# EAGLE design matrix_main_board (EAGLE 6.6.0)
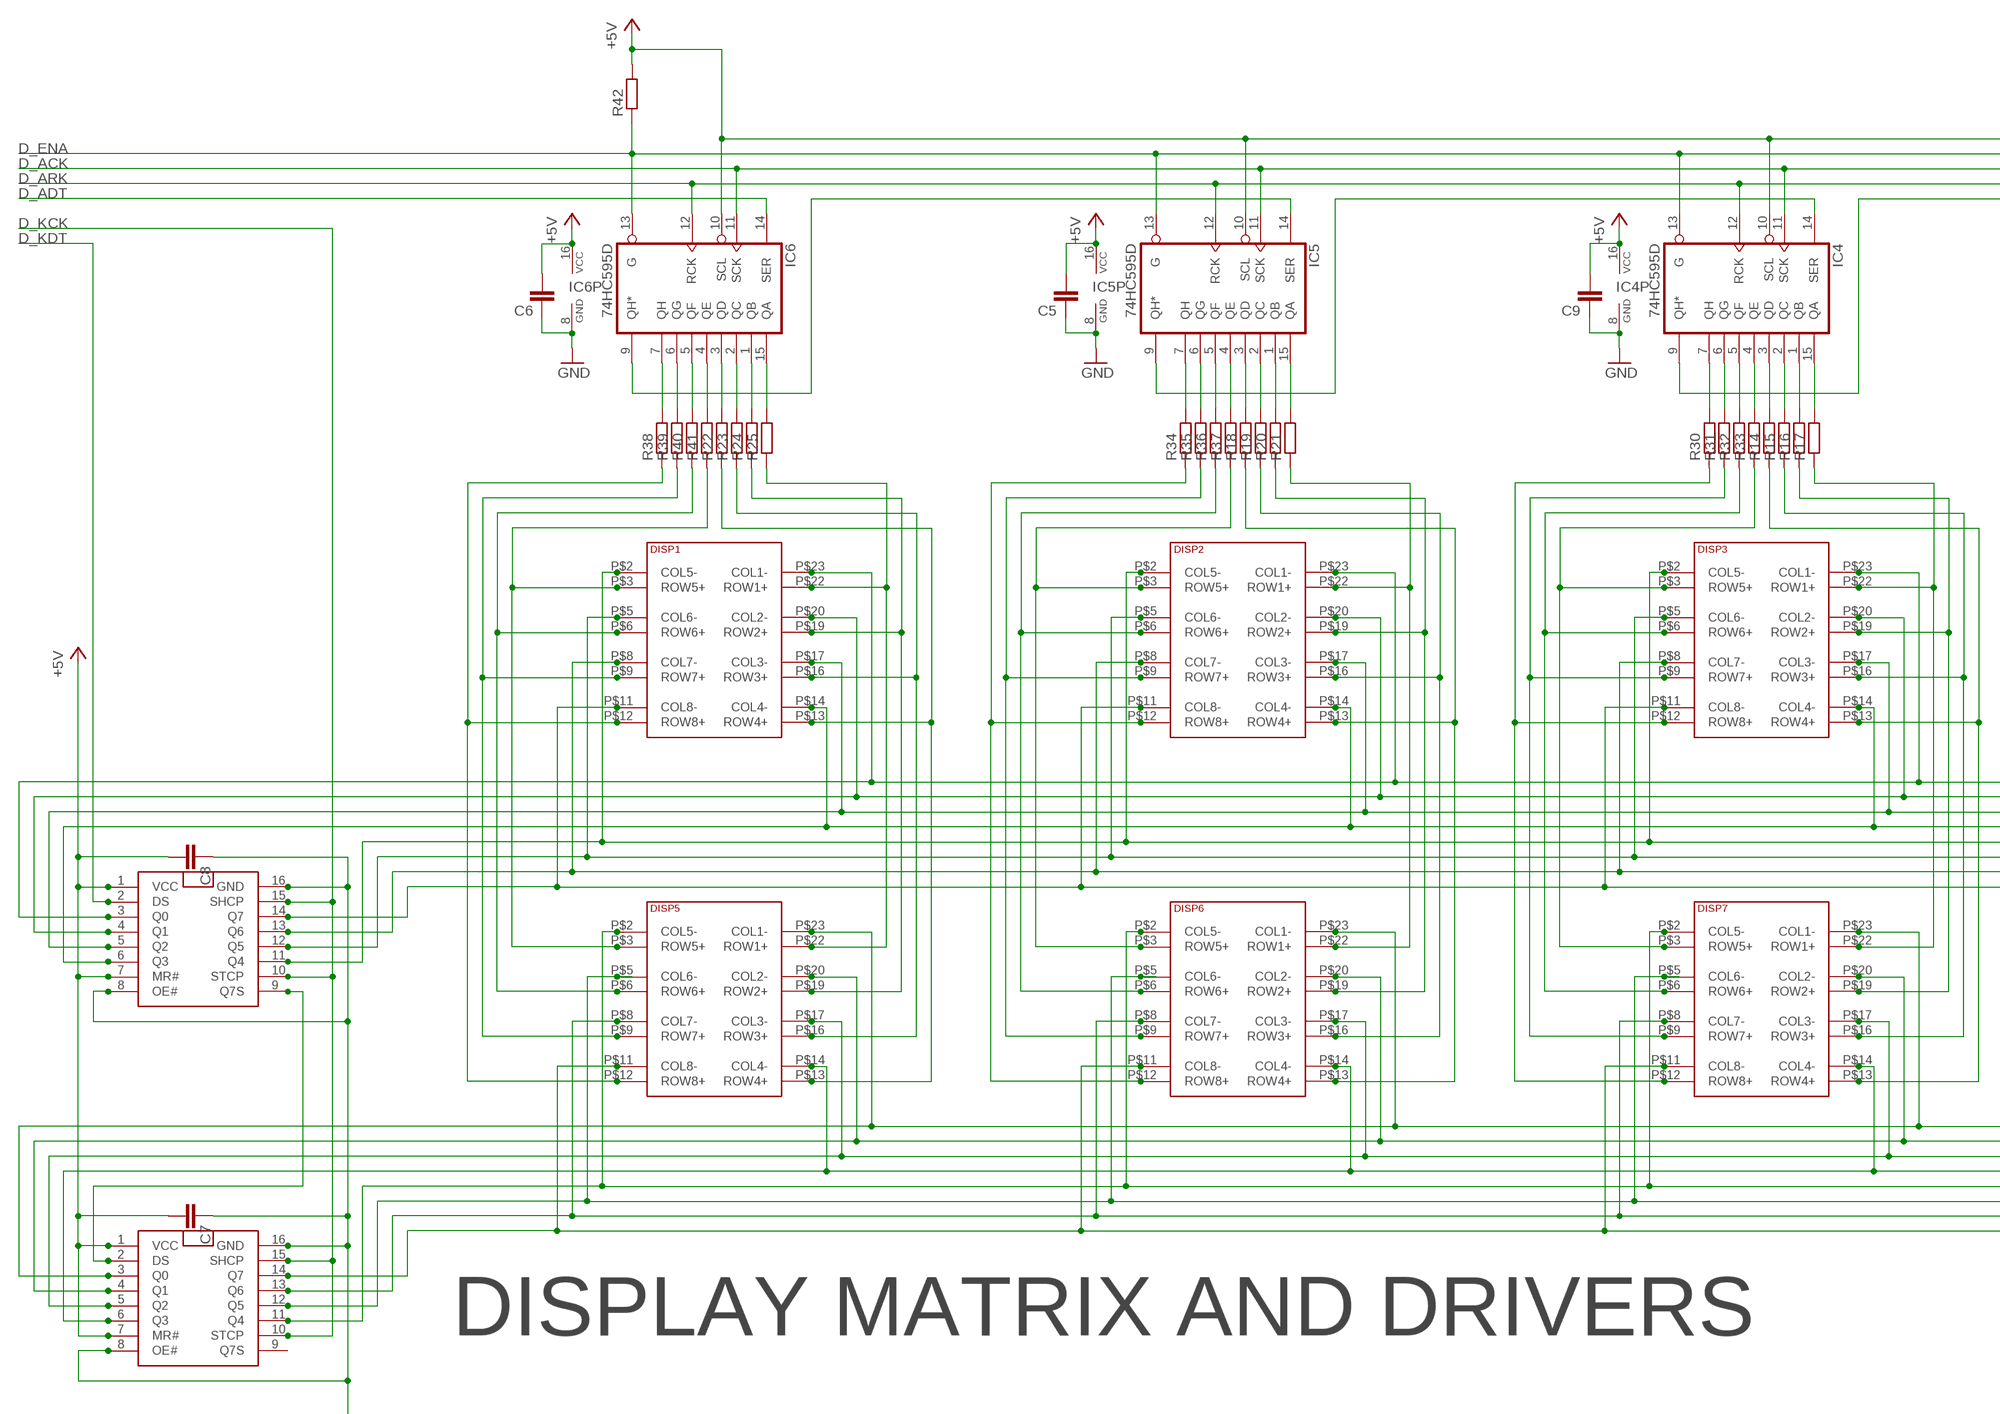
[diagram p0: schematic, sheet 1, part 1 of 3]
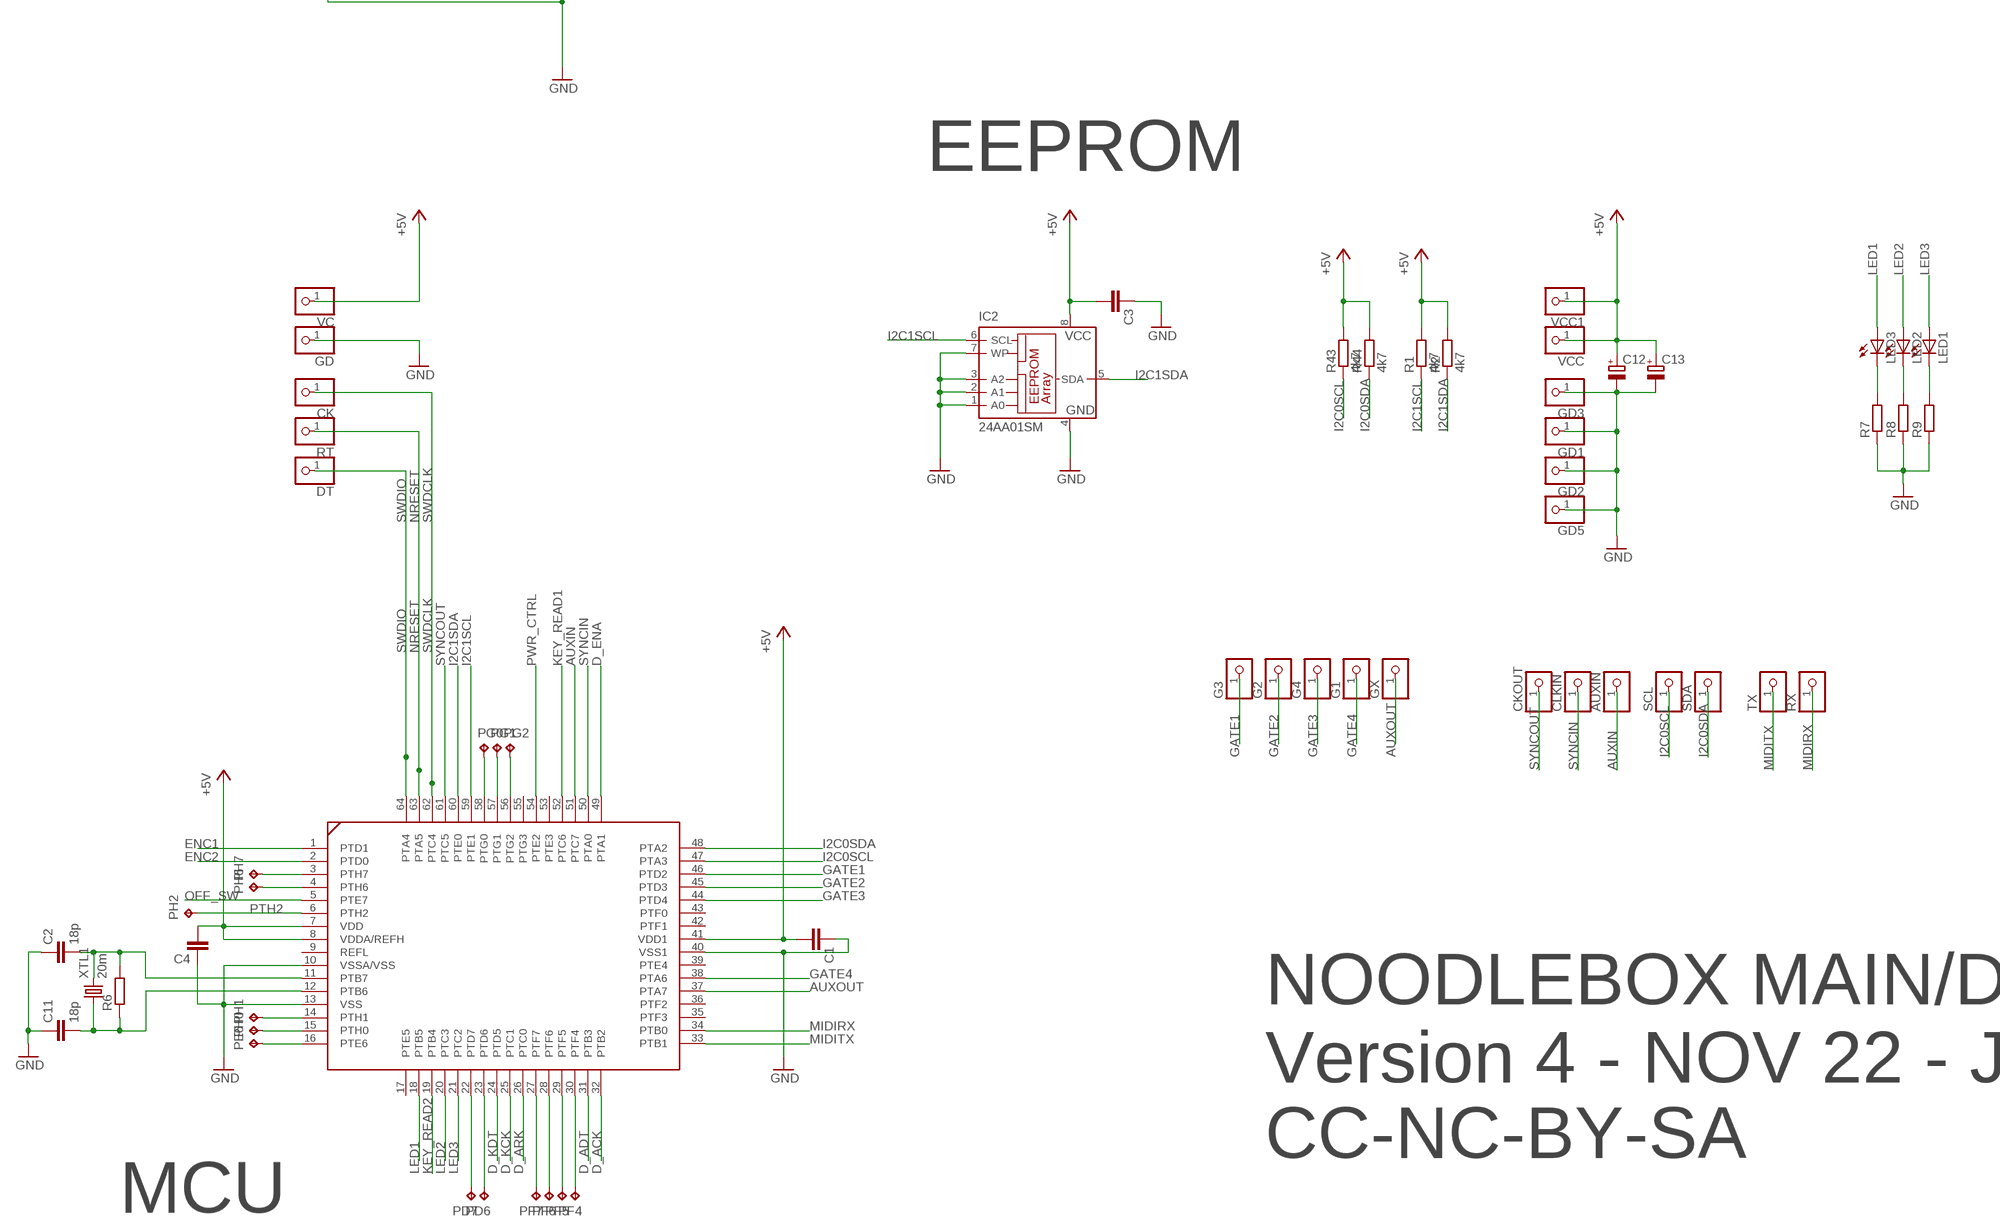
[diagram p1: schematic, sheet 1, part 2 of 3]
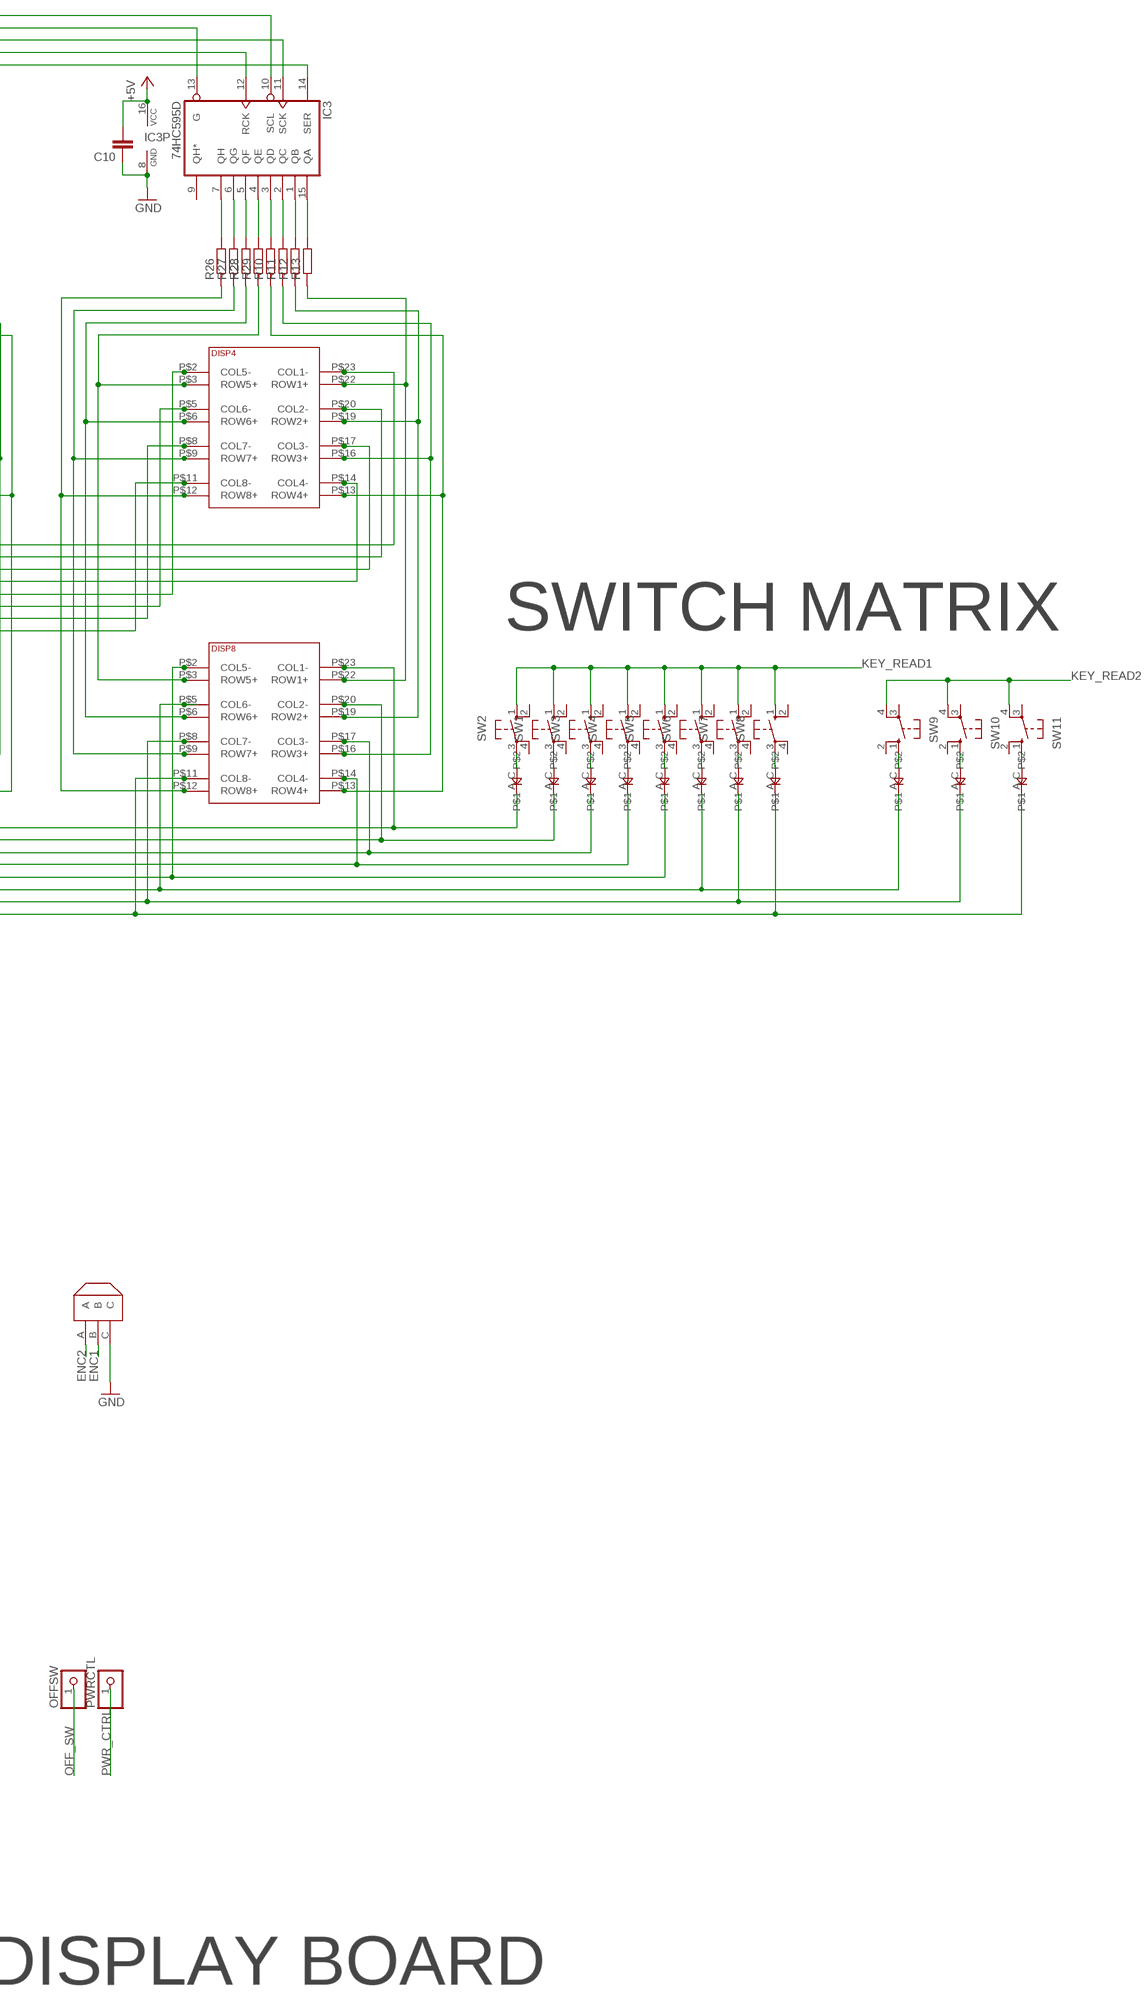
[diagram p2: schematic, sheet 1, part 3 of 3]

## Parts
AUXIN  PINHD-1X1  [1X01]
C1  C-EUC0805  [C0805]
C2  18p  C-EUC0805  [C0805]
C3  C-EUC0805  [C0805]
C4  C-EUC0805  [C0805]
C5  C-EUC0805  [C0805]
C6  C-EUC0805  [C0805]
C7  C-EUC0805  [C0805]
C8  C-EUC0805  [C0805]
C9  C-EUC0805  [C0805]
C10  C-EUC0805  [C0805]
C11  18p  C-EUC0805  [C0805]
C12  CPOL-EUE2.5-7  [E2,5-7]
C13  CPOL-EUE2.5-7  [E2,5-7]
CK  PINHD-1X1  [1X01]
CKOUT  PINHD-1X1  [1X01]
CLKIN  PINHD-1X1  [1X01]
D1  0805DIODE  [0805DIODE]
D2  0805DIODE  [0805DIODE]
D3  0805DIODE  [0805DIODE]
D4  0805DIODE  [0805DIODE]
D5  0805DIODE  [0805DIODE]
D6  0805DIODE  [0805DIODE]
D7  0805DIODE  [0805DIODE]
D8  0805DIODE  [0805DIODE]
D9  0805DIODE  [0805DIODE]
D10  0805DIODE  [0805DIODE]
D11  0805DIODE  [0805DIODE]
DISP1  1388BBMATRIX24PIN  [1388_24PIN]
DISP2  1388BBMATRIX24PIN  [1388_24PIN]
DISP3  1388BBMATRIX24PIN  [1388_24PIN]
DISP4  1388BBMATRIX24PIN  [1388_24PIN]
DISP5  1388BBMATRIX24PIN  [1388_24PIN]
DISP6  1388BBMATRIX24PIN  [1388_24PIN]
DISP7  1388BBMATRIX24PIN  [1388_24PIN]
DISP8  1388BBMATRIX24PIN  [1388_24PIN]
DT  PINHD-1X1  [1X01]
ENC1  ENCODER  [ENCODER]
G1  PINHD-1X1  [1X01]
G2  PINHD-1X1  [1X01]
G3  PINHD-1X1  [1X01]
G4  PINHD-1X1  [1X01]
GD  PINHD-1X1  [1X01]
GD1  PINHD-1X1  [1X01]
GD2  PINHD-1X1  [1X01]
GD3  PINHD-1X1  [1X01]
GD5  PINHD-1X1  [1X01]
GX  PINHD-1X1  [1X01]
IC1  MKE02_64PINQFP64  [QFP64_SOT393]
IC2  24AA01SM  [SO-08M]
IC3  74HC595D  [SO16]
IC4  74HC595D  [SO16]
IC5  74HC595D  [SO16]
IC6  74HC595D  [SO16]
IC7  NPIC6C596  [SO16]
IC8  NPIC6C596  [SO16]
LED1  LED3MM  [LED3MM]
LED2  LED3MM  [LED3MM]
LED3  LED3MM  [LED3MM]
OFFSW  PINHD-1X1  [1X01]
PD6  TPTP17R  [TP17R]
PD7  TPTP17R  [TP17R]
PE6  TPTP17R  [TP17R]
PF4  TPTP17R  [TP17R]
PF5  TPTP17R  [TP17R]
PF6  TPTP17R  [TP17R]
PF7  TPTP17R  [TP17R]
PG0  TPTP17R  [TP17R]
PG1  TPTP17R  [TP17R]
PG2  TPTP17R  [TP17R]
PH0  TPTP17R  [TP17R]
PH1  TPTP17R  [TP17R]
PH2  TPTP17R  [TP17R]
PH6  TPTP17R  [TP17R]
PH7  TPTP17R  [TP17R]
PWRCTL  PINHD-1X1  [1X01]
R1  4k7  R-EU_R0805  [R0805]
R2  4k7  R-EU_R0805  [R0805]
R6  R-EU_R0805  [R0805]
R7  R-EU_R0805  [R0805]
R8  R-EU_R0805  [R0805]
R9  R-EU_R0805  [R0805]
R10  R-EU_R0805  [R0805]
R11  R-EU_R0805  [R0805]
R12  R-EU_R0805  [R0805]
R13  R-EU_R0805  [R0805]
R14  R-EU_R0805  [R0805]
R15  R-EU_R0805  [R0805]
R16  R-EU_R0805  [R0805]
R17  R-EU_R0805  [R0805]
R18  R-EU_R0805  [R0805]
R19  R-EU_R0805  [R0805]
R20  R-EU_R0805  [R0805]
R21  R-EU_R0805  [R0805]
R22  R-EU_R0805  [R0805]
R23  R-EU_R0805  [R0805]
R24  R-EU_R0805  [R0805]
R25  R-EU_R0805  [R0805]
R26  R-EU_R0805  [R0805]
R27  R-EU_R0805  [R0805]
R28  R-EU_R0805  [R0805]
R29  R-EU_R0805  [R0805]
R30  R-EU_R0805  [R0805]
R31  R-EU_R0805  [R0805]
R32  R-EU_R0805  [R0805]
R33  R-EU_R0805  [R0805]
R34  R-EU_R0805  [R0805]
R35  R-EU_R0805  [R0805]
R36  R-EU_R0805  [R0805]
R37  R-EU_R0805  [R0805]
R38  R-EU_R0805  [R0805]
R39  R-EU_R0805  [R0805]
R40  R-EU_R0805  [R0805]
R41  R-EU_R0805  [R0805]
R42  R-EU_R0805  [R0805]
R43  4k7  R-EU_R0805  [R0805]
R44  4k7  R-EU_R0805  [R0805]
RT  PINHD-1X1  [1X01]
RX  PINHD-1X1  [1X01]
SCL  PINHD-1X1  [1X01]
SDA  PINHD-1X1  [1X01]
SW1  40-XX  [B3F-40XX]
SW2  40-XX  [B3F-40XX]
SW3  40-XX  [B3F-40XX]
SW4  40-XX  [B3F-40XX]
SW5  40-XX  [B3F-40XX]
SW6  40-XX  [B3F-40XX]
SW7  40-XX  [B3F-40XX]
SW8  40-XX  [B3F-40XX]
SW9  10-XX  [B3F-10XX]
SW10  10-XX  [B3F-10XX]
SW11  10-XX  [B3F-10XX]
TX  PINHD-1X1  [1X01]
VC  PINHD-1X1  [1X01]
VCC  PINHD-1X1  [1X01]
VCC1  PINHD-1X1  [1X01]
XTL1  20m  CRYSTALHC49S  [HC49/S]

## Nets
+5V: C1.2 C3.2 C4.2 C5.2 C6.2 C7.2 C8.2 C9.2 C10.2 C12.+ C13.+ IC1.7(VDD) IC1.8(VDDA/REFH) IC1.41(VDD1) IC2.8(VCC) IC3.10(SCL) IC3.16(VCC) IC4.10(SCL) IC4.16(VCC) IC5.10(SCL) IC5.16(VCC) IC6.10(SCL) IC6.16(VCC) IC7.1(VCC) IC7.7(MR#) IC8.1(VCC) IC8.7(MR#) R1.2 R2.2 R42.2 R43.2 R44.2 VC.1 VCC1.1 VCC.1
A0: DISP1.P$22(ROW1+) DISP5.P$22(ROW1+) R25.1
A1: DISP1.P$19(ROW2+) DISP5.P$19(ROW2+) R24.1
A2: DISP1.P$16(ROW3+) DISP5.P$16(ROW3+) R23.1
A3: DISP1.P$13(ROW4+) DISP5.P$13(ROW4+) R22.1
A4: DISP1.P$3(ROW5+) DISP5.P$3(ROW5+) R41.1
A5: DISP1.P$6(ROW6+) DISP5.P$6(ROW6+) R40.1
A6: DISP1.P$9(ROW7+) DISP5.P$9(ROW7+) R39.1
A7: DISP1.P$12(ROW8+) DISP5.P$12(ROW8+) R38.1
A8: DISP2.P$22(ROW1+) DISP6.P$22(ROW1+) R21.1
A9: DISP2.P$19(ROW2+) DISP6.P$19(ROW2+) R20.1
A10: DISP2.P$16(ROW3+) DISP6.P$16(ROW3+) R19.1
A11: DISP2.P$13(ROW4+) DISP6.P$13(ROW4+) R18.1
A12: DISP2.P$3(ROW5+) DISP6.P$3(ROW5+) R37.1
A13: DISP2.P$6(ROW6+) DISP6.P$6(ROW6+) R36.1
A14: DISP2.P$9(ROW7+) DISP6.P$9(ROW7+) R35.1
A15: DISP2.P$12(ROW8+) DISP6.P$12(ROW8+) R34.1
A16: DISP3.P$22(ROW1+) DISP7.P$22(ROW1+) R17.1
A17: DISP3.P$19(ROW2+) DISP7.P$19(ROW2+) R16.1
A18: DISP3.P$16(ROW3+) DISP7.P$16(ROW3+) R15.1
A19: DISP3.P$13(ROW4+) DISP7.P$13(ROW4+) R14.1
A20: DISP3.P$3(ROW5+) DISP7.P$3(ROW5+) R33.1
A21: DISP3.P$6(ROW6+) DISP7.P$6(ROW6+) R32.1
A22: DISP3.P$9(ROW7+) DISP7.P$9(ROW7+) R31.1
A23: DISP3.P$12(ROW8+) DISP7.P$12(ROW8+) R30.1
A24: DISP4.P$22(ROW1+) DISP8.P$22(ROW1+) R13.1
A25: DISP4.P$19(ROW2+) DISP8.P$19(ROW2+) R12.1
A26: DISP4.P$16(ROW3+) DISP8.P$16(ROW3+) R11.1
A27: DISP4.P$13(ROW4+) DISP8.P$13(ROW4+) R10.1
A28: DISP4.P$3(ROW5+) DISP8.P$3(ROW5+) R29.1
A29: DISP4.P$6(ROW6+) DISP8.P$6(ROW6+) R28.1
A30: DISP4.P$9(ROW7+) DISP8.P$9(ROW7+) R27.1
A31: DISP4.P$12(ROW8+) DISP8.P$12(ROW8+) R26.1
AUXIN: AUXIN.1 IC1.51(PTC7)
AUXOUT: GX.1 IC1.37(PTA7)
D_ACK: IC1.32(PTB2) IC3.11(SCK) IC4.11(SCK) IC5.11(SCK) IC6.11(SCK)
D_ADT: IC1.31(PTB3) IC6.14(SER)
D_ARK: IC1.26(PTC0) IC3.12(RCK) IC4.12(RCK) IC5.12(RCK) IC6.12(RCK)
D_ENA: IC1.49(PTA1) IC3.13(G) IC4.13(G) IC5.13(G) IC6.13(G) R42.1
D_KCK: IC1.25(PTC1) IC7.10(STCP) IC7.15(SHCP) IC8.10(STCP) IC8.15(SHCP)
D_KDT: IC1.24(PTD5) IC8.2(DS)
ENC1: ENC1.B IC1.1(PTD1)
ENC2: ENC1.A IC1.2(PTD0)
GATE1: G3.1 IC1.46(PTD2)
GATE2: G2.1 IC1.45(PTD3)
GATE3: G4.1 IC1.44(PTD4)
GATE4: G1.1 IC1.38(PTA6)
GND: C1.1 C2.1 C3.1 C4.1 C5.1 C6.1 C7.1 C8.1 C9.1 C10.1 C11.1 C12.- C13.- ENC1.C GD1.1 GD2.1 GD3.1 GD5.1 GD.1 IC1.10(VSSA/VSS) IC1.13(VSS) IC1.40(VSS1) IC2.1(A0) IC2.2(A1) IC2.3(A2) IC2.4(GND) IC2.7(WP) IC3.8(GND) IC4.8(GND) IC5.8(GND) IC6.8(GND) IC7.8(OE#) IC7.16(GND) IC8.8(OE#) IC8.16(GND) R7.1 R8.1 R9.1
I2C0SCL: IC1.47(PTA3) R43.1 SCL.1
I2C0SDA: IC1.48(PTA2) R44.1 SDA.1
I2C1SCL: IC1.59(PTE1) IC2.6(SCL) R1.1
I2C1SDA: IC1.60(PTE0) IC2.5(SDA) R2.1
K0: DISP1.P$23(COL1-) DISP2.P$23(COL1-) DISP3.P$23(COL1-) DISP4.P$23(COL1-) IC8.3(Q0)
K1: DISP1.P$20(COL2-) DISP2.P$20(COL2-) DISP3.P$20(COL2-) DISP4.P$20(COL2-) IC8.4(Q1)
K2: DISP1.P$17(COL3-) DISP2.P$17(COL3-) DISP3.P$17(COL3-) DISP4.P$17(COL3-) IC8.5(Q2)
K3: DISP1.P$14(COL4-) DISP2.P$14(COL4-) DISP3.P$14(COL4-) DISP4.P$14(COL4-) IC8.6(Q3)
K4: DISP1.P$2(COL5-) DISP2.P$2(COL5-) DISP3.P$2(COL5-) DISP4.P$2(COL5-) IC8.11(Q4)
K5: DISP1.P$5(COL6-) DISP2.P$5(COL6-) DISP3.P$5(COL6-) DISP4.P$5(COL6-) IC8.12(Q5)
K6: DISP1.P$8(COL7-) DISP2.P$8(COL7-) DISP3.P$8(COL7-) DISP4.P$8(COL7-) IC8.13(Q6)
K7: DISP1.P$11(COL8-) DISP2.P$11(COL8-) DISP3.P$11(COL8-) DISP4.P$11(COL8-) IC8.14(Q7)
K8: D7.A DISP5.P$23(COL1-) DISP6.P$23(COL1-) DISP7.P$23(COL1-) DISP8.P$23(COL1-) IC7.3(Q0)
K9: D8.A DISP5.P$20(COL2-) DISP6.P$20(COL2-) DISP7.P$20(COL2-) DISP8.P$20(COL2-) IC7.4(Q1)
K10: D6.A DISP5.P$17(COL3-) DISP6.P$17(COL3-) DISP7.P$17(COL3-) DISP8.P$17(COL3-) IC7.5(Q2)
K11: D5.A DISP5.P$14(COL4-) DISP6.P$14(COL4-) DISP7.P$14(COL4-) DISP8.P$14(COL4-) IC7.6(Q3)
K12: D4.A DISP5.P$2(COL5-) DISP6.P$2(COL5-) DISP7.P$2(COL5-) DISP8.P$2(COL5-) IC7.11(Q4)
K13: D3.A D11.A DISP5.P$5(COL6-) DISP6.P$5(COL6-) DISP7.P$5(COL6-) DISP8.P$5(COL6-) IC7.12(Q5)
K14: D2.A D10.A DISP5.P$8(COL7-) DISP6.P$8(COL7-) DISP7.P$8(COL7-) DISP8.P$8(COL7-) IC7.13(Q6)
K15: D1.A D9.A DISP5.P$11(COL8-) DISP6.P$11(COL8-) DISP7.P$11(COL8-) DISP8.P$11(COL8-) IC7.14(Q7)
KEY_READ1: IC1.52(PTC6) SW1.1(S) SW2.1(S) SW3.1(S) SW4.1(S) SW5.1(S) SW6.1(S) SW7.1(S) SW8.1(S)
KEY_READ2: IC1.19(PTB4) SW9.4(P1) SW10.4(P1) SW11.4(P1)
LED1: IC1.18(PTB5) LED3.A
LED2: IC1.20(PTC3) LED2.A
LED3: IC1.21(PTC2) LED1.A
MIDIRX: IC1.34(PTB0) RX.1
MIDITX: IC1.33(PTB1) TX.1
N$1: D10.C SW10.1(S)
N$2: LED3.K(C) R7.2
N$3: LED2.K(C) R8.2
N$4: C2.2 IC1.11(PTB7) R6.2 XTL1.2
N$5: C11.2 IC1.12(PTB6) R6.1 XTL1.1
N$6: LED1.K(C) R9.2
N$7: D9.C SW11.1(S)
N$8: D11.C SW9.1(S)
N$9: D7.C SW2.3(P)
N$10: IC1.22(PTD7) PD7.TP
N$11: D8.C SW1.3(P)
N$12: IC1.23(PTD6) PD6.TP
N$13: D6.C SW3.3(P)
N$14: D5.C SW4.3(P)
N$15: IC1.27(PTF7) PF7.TP
N$16: D4.C SW5.3(P)
N$17: IC6.15(QA) R25.2
N$18: IC6.1(QB) R24.2
N$19: IC6.2(QC) R23.2
N$20: IC6.3(QD) R22.2
N$21: IC6.4(QE) R41.2
N$22: IC6.5(QF) R40.2
N$23: IC6.6(QG) R39.2
N$24: IC6.7(QH) R38.2
N$25: IC1.28(PTF6) PF6.TP
N$26: IC1.29(PTF5) PF5.TP
N$27: IC1.30(PTF4) PF4.TP
N$30: IC5.14(SER) IC6.9(QH*)
N$31: IC4.14(SER) IC5.9(QH*)
N$32: IC3.14(SER) IC4.9(QH*)
N$36: IC1.14(PTH1) PH1.TP
N$37: IC1.15(PTH0) PH0.TP
N$38: IC1.16(PTE6) PE6.TP
N$41: IC1.4(PTH6) PH6.TP
N$43: IC1.57(PTG1) PG1.TP
N$49: IC5.15(QA) R21.2
N$50: IC5.1(QB) R20.2
N$51: IC5.2(QC) R19.2
N$52: IC5.3(QD) R18.2
N$53: IC5.4(QE) R37.2
N$54: IC5.5(QF) R36.2
N$55: IC5.6(QG) R35.2
N$56: IC5.7(QH) R34.2
N$60: D3.C SW6.3(P)
N$61: D2.C SW7.3(P)
N$62: D1.C SW8.3(P)
N$81: IC4.15(QA) R17.2
N$82: IC4.1(QB) R16.2
N$83: IC4.2(QC) R15.2
N$84: IC4.3(QD) R14.2
N$85: IC4.4(QE) R33.2
N$86: IC4.5(QF) R32.2
N$87: IC4.6(QG) R31.2
N$88: IC4.7(QH) R30.2
N$113: IC3.15(QA) R13.2
N$114: IC3.1(QB) R12.2
N$115: IC3.2(QC) R11.2
N$116: IC3.3(QD) R10.2
N$117: IC3.4(QE) R29.2
N$118: IC3.5(QF) R28.2
N$119: IC3.6(QG) R27.2
N$120: IC3.7(QH) R26.2
N$122: IC7.2(DS) IC8.9(Q7S)
NRESET: IC1.63(PTA5) RT.1
OFF_SW: IC1.5(PTE7) OFFSW.1
PG0: IC1.58(PTG0) PG0.TP
PTG2: IC1.56(PTG2) PG2.TP
PTH2: IC1.6(PTH2) PH2.TP
PTH7: IC1.3(PTH7) PH7.TP
PWR_CTRL: IC1.54(PTE2) PWRCTL.1
SWDCLK: CK.1 IC1.62(PTC4)
SWDIO: DT.1 IC1.64(PTA4)
SYNCIN: CLKIN.1 IC1.50(PTA0)
SYNCOUT: CKOUT.1 IC1.61(PTC5)
Unconnected: IC1.9(REFL) IC1.17(PTE5) IC1.35(PTF3) IC1.36(PTF2) IC1.39(PTE4) IC1.42(PTF1) IC1.43(PTF0) IC1.53(PTE3) IC1.55(PTG3) IC3.9(QH*) IC7.9(Q7S) SW1.2(S1) SW1.4(P1) SW2.2(S1) SW2.4(P1) SW3.2(S1) SW3.4(P1) SW4.2(S1) SW4.4(P1) SW5.2(S1) SW5.4(P1) SW6.2(S1) SW6.4(P1) SW7.2(S1) SW7.4(P1) SW8.2(S1) SW8.4(P1) SW9.2(S1) SW9.3(P) SW10.2(S1) SW10.3(P) SW11.2(S1) SW11.3(P)

## Notes on the sheet
- SWITCH MATRIX
- DISPLAY MATRIX AND DRIVERS
- EEPROM
- NOODLEBOX MAIN/DISPLAY BOARD
- Version 4 - NOV 22 - J Hotchkiss / Sixty Four Pixels
- CC-NC-BY-SA
- MCU

## Library data of the parts
AUXIN CK CKOUT CLKIN DT G1-G4 GD GD1-GD3 GD5 GX OFFSW PWRCTL RT RX SCL SDA TX VC VCC VCC1 = pinhead:PINHD-1X1: PIN HEADER
C1-C11 = rcl:C-EU: CAPACITOR, European symbol
C12 C13 = rcl:CPOL-EU: POLARIZED CAPACITOR, European symbol
D1-D11 = jasons_stuff:0805DIODE
DISP1-DISP8 = jason_eagle6:1388BBMATRIX
ENC1 = jason_eagle6:ENCODER: "PEC16-4220F-N0024"
IC1 = jason_eagle6:MKE02_64PIN
IC2 = microchip:24*: Serial EEPROM I2C; MF: MICROCHIP; MPN: 24AA01-I/SN; OC_FARNELL: 1331268; OC_NEWARK: 92C6793
IC3-IC6 = 74xx-eu:74*595: 8-bit SHIFT REGISTER, output latch
IC7 IC8 = jasons_stuff:NPIC6C596
LED1-LED3 = led:LED: LED OSRAM: - CHIPLED LG R971, LG N971, LY N971, LG Q971, LY Q971, LO R971, LY R971 LH N974, LH R974 LS Q976, LO Q976, LY Q976 LO Q996 - Hyper CHIPLED LW Q18S LB Q993, LB Q99A, LB R99A - SideLED LS A670, LO A670, LY A670, LG A670, LP A670 LB A673, LV A673, LT A673, LW A673 LH A674 LY A675 LS A676, LA A676, LO A676, LY A676, LW A676 LS A679, LY A679, LG A679 - Hyper Micro SIDELED® LS Y876, LA Y876, LO Y876, LY Y876 LT Y87S - SmartLED LW L88C, LW L88S LB L89C, LB L89S, LG L890 LS L89K, LO L89K, LY L89K LS L896, LA L896, LO L896, LY L896 - TOPLED LS T670, LO T670, LY T670, LG T670, LP T670 LSG T670, LSP T670, LSY T670, LOP T670, LYG T670 LG T671, LOG T671, LSG T671 LB T673, LV T673, LT T673, LW T673 LH T674 LS T676, LA T676, LO T676, LY T676, LB T676, LH T676, LSB T676, LW T676 LB T67C, LV T67C, LT T67C, LS T67K, LO T67K, LY T67K, LW E67C LS E67B, LA E67B, LO E67B, LY E67B, LB E67C, LV E67C, LT E67C LW T67C LS T679, LY T679, LG T679 LS T770, LO T770, LY T770, LG T770, LP T770 LB T773, LV T773, LT T773, LW T773 LH T774 LS E675, LA E675, LY E675, LS T675 LS T776, LA T776, LO T776, LY T776, LB T776 LHGB T686 LT T68C, LB T68C - Hyper Mini TOPLED® LB M676 - Mini TOPLED Santana® LG M470 LS M47K, LO M47K, LY M47K Source: http://www.osram.convergy.de LUXEON: - LUMILED® LXK2-PW12-R00, LXK2-PW12-S00, LXK2-PW14-U00, LXK2-PW14-V00 LXK2-PM12-R00, LXK2-PM12-S00, LXK2-PM14-U00 LXK2-PE12-Q00, LXK2-PE12-R00, LXK2-PE12-S00, LXK2-PE14-T00, LXK2-PE14-U00 LXK2-PB12-K00, LXK2-PB12-L00, LXK2-PB12-M00, LXK2-PB14-N00, LXK2-PB14-P00, LXK2-PB14-Q00 LXK2-PR12-L00, LXK2-PR12-M00, LXK2-PR14-Q00, LXK2-PR14-R00 LXK2-PD12-Q00, LXK2-PD12-R00, LXK2-PD12-S00 LXK2-PH12-R00, LXK2-PH12-S00 LXK2-PL12-P00, LXK2-PL12-Q00, LXK2-PL12-R00 Source: www.luxeon.com KINGBRIGHT: KA-3528ASYC Source: www.kingbright.com
PD6 PD7 PE6 PF4-PF7 PG0 PG1 PG2 PH0 PH1 PH2 PH6 PH7 = testpad:TP: Test pad
R1 R2 R6-R44 = rcl:R-EU_: RESISTOR, European symbol
SW1-SW8 = switch-omron:40-XX: OMRON SWITCH; MF: OMRON COMPONENTS USA; MPN: B3F-4000; OC_FARNELL: 176434; OC_NEWARK: 36K3105
SW9-SW11 = switch-omron:10-XX: OMRON SWITCH; MPN: B3F-1000; OC_FARNELL: 176432; OC_NEWARK: 36M3542
XTL1 = crystal:CRYSTAL: CRYSTAL; OC_FARNELL: 1667008; OC_NEWARK: unknown

## Board
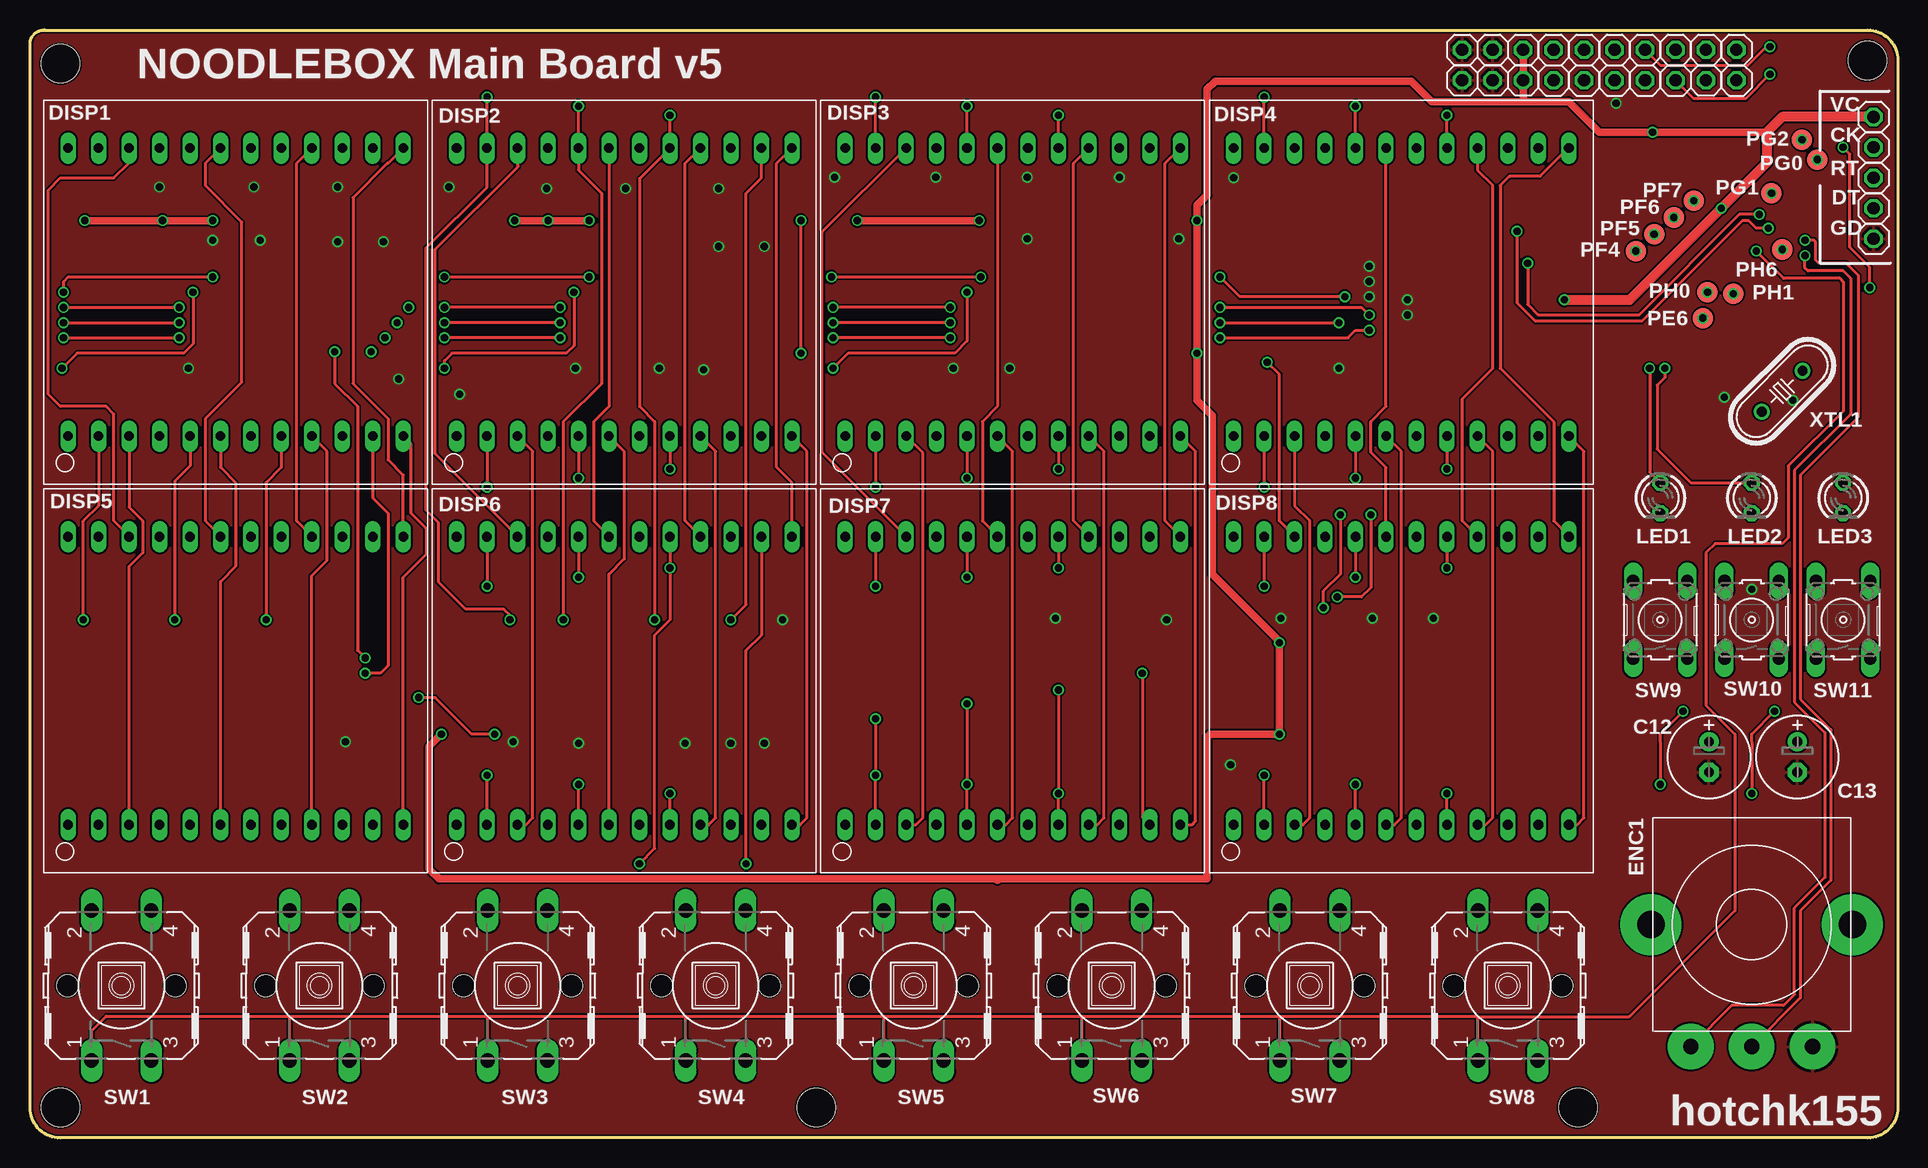
[diagram p3: board, top side]
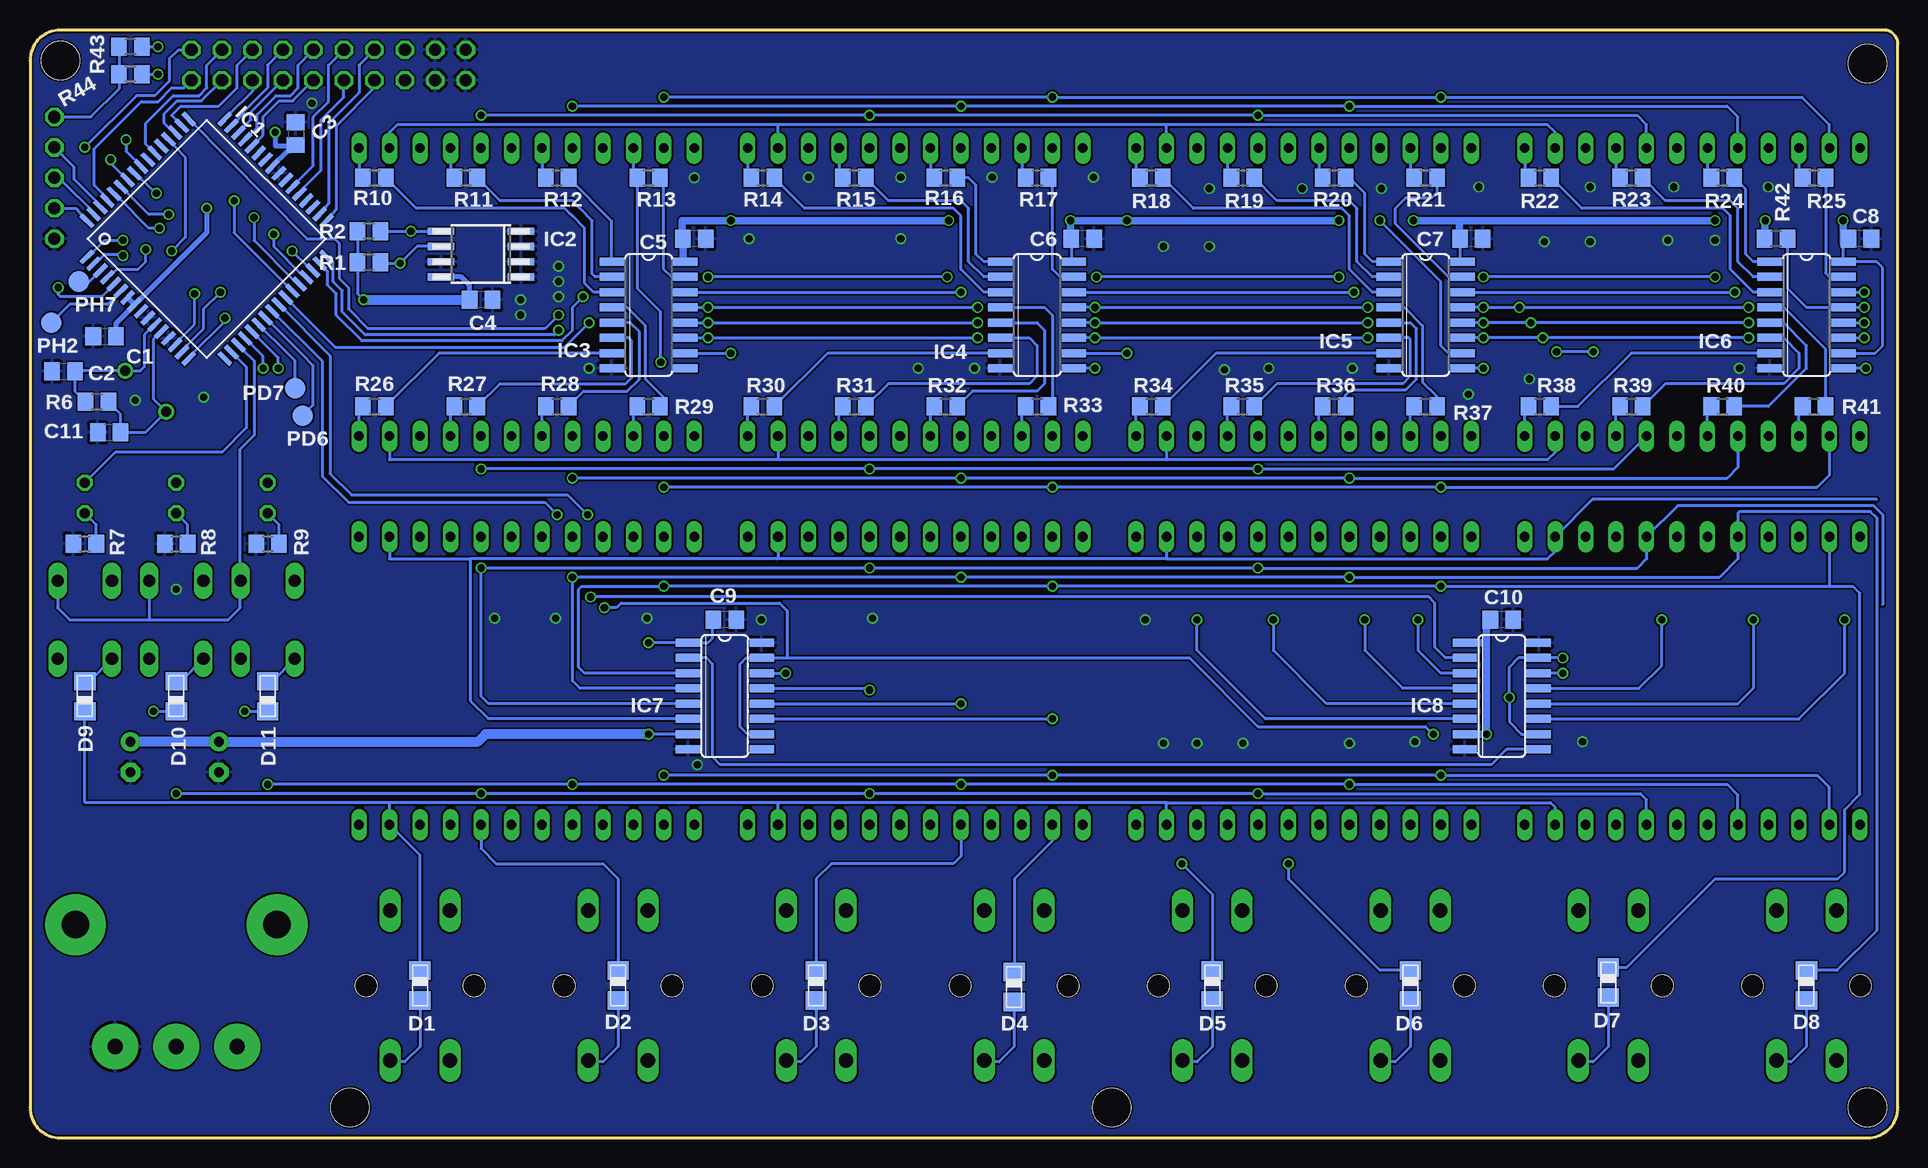
[diagram p4: board, bottom side, seen from below]

Size 155.7 x 92.33 mm. Coordinates in mm from the lower left corner, seen from the top.
Outline: 155.7,2.54 arc-90 153.16,0 2.54,0 arc-90 0,2.54 0,91.19 arc-93 1.27,92.33 153.16,92.33 arc-90 155.7,89.79 155.7,2.54
Copper layers (1*16): Top 0.035mm / dielectric 1.5mm / Bottom 0.035mm
Design rules "hackvana": minimum track width 6mil, minimum drill 0.3mm, track to track 6mil, track to pad 9mil, pad to pad 6mil, via to via 6mil, smd to smd 0mil, copper to edge 6mil, drill to drill 6mil, minimum pad ring 10mil, minimum via ring 6mil, stop-mask expansion 2mil, vias tented up to drill 100mil, thermal gap 10mil
Holes 3.2 mm at 2.54,2.54 2.54,89.53 153.16,89.79 65.53,2.54 129.03,2.54

### Footprints (pad centres in the part's own frame; a part is rotated, then mirrored left to right if it is on the bottom)
1X01 = drill 1.016 octagon: 1 0,0
C0805 = smd 1.3 x 1.5: 1 -0.95,0; 2 0.95,0
E2,5-7 = drill 0.813 pad 1.6: + -1.27,0 | drill 0.813 pad 1.6 octagon: - 1.27,0
0805DIODE = smd 1.524 x 1.778: A -1.262,-0.005; C 1.238,-0.005
1388_24PIN = drill 0.8 long: P$1 -13.97,-12; P$2 -11.43,-12; P$3 -8.89,-12; P$4 -6.35,-12; P$5 -3.81,-12; P$6 -1.27,-12; P$7 1.27,-12; P$8 3.81,-12; P$9 6.35,-12; P$10 8.89,-12; P$11 11.43,-12; P$12 13.97,-12; P$13 13.97,12; P$14 11.43,12; P$15 8.89,12; P$16 6.35,12; P$17 3.81,12; P$18 1.27,12; P$19 -1.27,12; P$20 -3.81,12; P$21 -6.35,12; P$22 -8.89,12; P$23 -11.43,12; P$24 -13.97,12
ENCODER = drill 1.27 pad 3.81: A 5.08,10.16; B 0,10.16; C -5.08,10.16 | drill 2.286 pad 5.08: P$1 8.4,0; P$2 -8.4,0
QFP64_SOT393 = smd 0.4 x 1.4: 1 -6,-8.125; 2 -5.2,-8.125; 3 -4.4,-8.125; 4 -3.6,-8.125; 5 -2.8,-8.125; 6 -2,-8.125; 7 -1.2,-8.125; 8 -0.4,-8.125; 9 0.4,-8.125; 10 1.2,-8.125; 11 2,-8.125; 12 2.8,-8.125; 13 3.6,-8.125; 14 4.4,-8.125; 15 5.2,-8.125; 16 6,-8.125; 33 6,8.125; 34 5.2,8.125; 35 4.4,8.125; 36 3.6,8.125; 37 2.8,8.125; 38 2,8.125; 39 1.2,8.125; 40 0.4,8.125; 41 -0.4,8.125; 42 -1.2,8.125; 43 -2,8.125; 44 -2.8,8.125; 45 -3.6,8.125; 46 -4.4,8.125; 47 -5.2,8.125; 48 -6,8.125 | smd 1.4 x 0.4: 17 8.125,-6; 18 8.125,-5.2; 19 8.125,-4.4; 20 8.125,-3.6; 21 8.125,-2.8; 22 8.125,-2; 23 8.125,-1.2; 24 8.125,-0.4; 25 8.125,0.4; 26 8.125,1.2; 27 8.125,2; 28 8.125,2.8; 29 8.125,3.6; 30 8.125,4.4; 31 8.125,5.2; 32 8.125,6; 49 -8.125,6; 50 -8.125,5.2; 51 -8.125,4.4; 52 -8.125,3.6; 53 -8.125,2.8; 54 -8.125,2; 55 -8.125,1.2; 56 -8.125,0.4; 57 -8.125,-0.4; 58 -8.125,-1.2; 59 -8.125,-2; 60 -8.125,-2.8; 61 -8.125,-3.6; 62 -8.125,-4.4; 63 -8.125,-5.2; 64 -8.125,-6
SO-08M = smd 0.6 x 2.2: 1 -1.905,-3.33; 2 -0.635,-3.33; 3 0.635,-3.33; 4 1.905,-3.33; 5 1.905,3.33; 6 0.635,3.33; 7 -0.635,3.33; 8 -1.905,3.33
SO16 = smd 0.66 x 2.032: 1 -4.445,-3.073; 2 -3.175,-3.073; 3 -1.905,-3.073; 4 -0.635,-3.073; 5 0.635,-3.073; 6 1.905,-3.073; 7 3.175,-3.073; 8 4.445,-3.073; 9 4.445,3.073; 10 3.175,3.073; 11 1.905,3.073; 12 0.635,3.073; 13 -0.635,3.073; 14 -1.905,3.073; 15 -3.175,3.073; 16 -4.445,3.073
LED3MM = drill 0.813 octagon: A -1.27,0; K 1.27,0
TP17R = smd 1.7 x 1.7: TP 0,0
R0805 = smd 1.3 x 1.5: 1 -0.95,0; 2 0.95,0
B3F-40XX = drill 1.194 long: 1 -6.248,2.489; 2 6.248,2.489; 3 -6.248,-2.489; 4 6.248,-2.489 | hole 1.803: 0,-4.496; 0,4.496
B3F-10XX = drill 1.016 long: 1 -3.251,2.261; 2 3.251,2.261; 3 -3.251,-2.261; 4 3.251,-2.261
HC49/S = drill 0.813: 1 -2.413,0; 2 2.413,0

### Placement (x,y rotation side)
AUXIN  139.7,88.14 0 top
C1  149.48,66.8 0 bottom
C2  152.91,63.88 0 bottom
C3  133.54,83.69 270 bottom
C4  118.11,69.85 180 bottom
C5  100.33,74.93 180 bottom
C6  67.95,74.93 180 bottom
C7  35.56,74.93 180 bottom
C8  3.18,74.93 180 bottom
C9  97.79,43.18 180 bottom
C10  33.02,43.18 180 bottom
C11  149.1,58.8 0 bottom
C12  139.95,31.75 270 top
C13  147.32,31.75 270 top
CK  153.67,82.55 0 top
CKOUT  142.24,88.14 90 top
CLKIN  137.16,90.68 90 top
D1  123.19,12.7 270 bottom
D2  106.68,12.7 270 bottom
D3  90.17,12.7 270 bottom
D4  73.66,12.57 270 bottom
D5  57.15,12.7 270 bottom
D6  40.64,12.7 270 bottom
D7  24.13,12.95 270 bottom
D8  7.62,12.7 270 bottom
D9  151.13,36.83 90 bottom
D10  143.51,36.83 90 bottom
D11  135.89,36.83 90 bottom
DISP1  17.14,70.48 0 top
DISP2  49.53,70.48 0 top
DISP3  81.92,70.48 0 top
DISP4  114.3,70.48 0 top
DISP5  17.14,38.1 0 top
DISP6  49.53,38.1 0 top
DISP7  81.92,38.1 0 top
DISP8  114.3,38.1 0 top
DT  153.67,77.47 0 top
ENC1  143.51,17.78 180 top
G1  129.54,90.68 90 top
G2  132.08,90.68 90 top
G3  134.62,88.14 90 top
G4  132.08,88.14 90 top
GD  153.67,74.93 0 top
GD1  121.92,90.68 0 top
GD2  119.38,90.68 0 top
GD3  119.38,88.14 0 top
GD5  121.92,88.14 0 top
GX  129.54,88.14 90 top
IC1  140.97,74.93 315 bottom
IC2  118.11,73.66 90 bottom
IC3  104.14,68.58 270 bottom
IC4  71.76,68.58 270 bottom
IC5  39.37,68.58 270 bottom
IC6  7.62,68.58 270 bottom
IC7  97.79,36.83 270 bottom
IC8  33.02,36.83 270 bottom
LED1  135.89,53.34 270 top
LED2  143.51,53.34 270 top
LED3  151.13,53.34 270 top
OFFSW  142.24,90.68 90 top
PD6  132.97,60.2 0 bottom
PD7  133.6,62.48 0 bottom
PE6  139.45,68.33 0 top
PF4  133.86,73.91 0 top
PF5  135.38,75.31 0 top
PF6  137.03,76.71 0 top
PF7  138.68,78.11 0 top
PG0  148.97,81.53 90 top
PG1  145.16,78.74 90 top
PG2  147.7,83.19 90 top
PH0  139.83,70.48 0 top
PH1  141.99,70.36 0 top
PH2  153.92,67.94 0 bottom
PH6  146.05,74.04 0 top
PH7  151.64,71.37 0 bottom
PWRCTL  139.7,90.68 90 top
R1  127.44,72.96 180 bottom
R2  127.44,75.56 180 bottom
R6  150.11,61.34 180 bottom
R7  151.13,49.53 0 bottom
R8  143.51,49.53 0 bottom
R9  135.89,49.53 0 bottom
R10  127,80.01 0 bottom
R11  119.38,80.01 0 bottom
R12  111.76,80.01 0 bottom
R13  104.14,80.01 0 bottom
R14  94.62,80.01 0 bottom
R15  87,80.01 0 bottom
R16  79.38,80.01 0 bottom
R17  71.76,80.01 0 bottom
R18  62.23,80.01 0 bottom
R19  54.61,80.01 0 bottom
R20  46.99,80.01 0 bottom
R21  39.37,80.01 0 bottom
R22  29.84,80.01 0 bottom
R23  22.23,80.01 0 bottom
R24  14.61,80.01 0 bottom
R25  6.99,80.01 0 bottom
R26  127,60.96 0 bottom
R27  119.38,60.96 0 bottom
R28  111.76,60.96 0 bottom
R29  104.14,60.96 0 bottom
R30  94.62,60.96 0 bottom
R31  87,60.96 0 bottom
R32  79.38,60.96 0 bottom
R33  71.76,60.96 0 bottom
R34  62.23,60.96 0 bottom
R35  54.61,60.96 0 bottom
R36  46.99,60.96 0 bottom
R37  39.37,60.96 0 bottom
R38  29.84,60.96 0 bottom
R39  22.23,60.96 0 bottom
R40  14.61,60.96 0 bottom
R41  6.99,60.96 0 bottom
R42  10.16,74.93 180 bottom
R43  147.32,90.93 180 bottom
R44  147.32,88.65 180 bottom
RT  153.67,80.01 0 top
RX  127,90.68 90 top
SCL  134.62,90.68 90 top
SDA  137.16,88.14 90 top
SW1  7.62,12.7 90 top
SW2  24.13,12.7 90 top
SW3  40.64,12.7 90 top
SW4  57.15,12.7 90 top
SW5  73.66,12.7 90 top
SW6  90.17,12.7 90 top
SW7  106.68,12.7 90 top
SW8  123.19,12.7 90 top
SW9  135.89,43.18 90 top
SW10  143.51,43.18 90 top
SW11  151.13,43.18 90 top
TX  127,88.14 90 top
VC  153.67,85.09 0 top
VCC  124.46,90.68 0 top
VCC1  124.46,88.14 0 top
XTL1  146.05,62.23 45 top

### Tracks (layer width: path | path; a pad name or v marks a point on that pad's centre or on a via)
+5V  (via drill 0.6, 0.6 pad 0.25)
  Top 0.254: v64.26,65.41 v64.26,76.45 | v43.18,76.45 40.89,76.45 40.64,76.2
  Top 0.61: 80.77,21.59 98.11,21.59 98.11,33.4 98.36,33.66 v104.14,33.66 v104.14,41.27 104.14,41.4 98.55,46.99 98.55,60.2 97.28,61.47 v97.28,65.41 v97.28,76.45 97.28,77.72 98.11,78.55 98.11,87.38 98.81,88.08 115.12,88.08 116.84,86.36 124.46,86.36 | 80.77,21.59 34.1,21.59 33.27,22.42 33.27,32.64 v34.29,33.66 | 80.65,21.46 80.77,21.59 | v4.57,76.45 v11.05,76.45 v15.24,76.45 | v40.39,76.45 v43.18,76.45 v46.61,76.45 | v68.96,76.45 v79.12,76.45 | 124.46,86.36 128.27,86.36 130.81,83.82 v135.25,83.82 144.78,83.82 | VCC.1 VCC1.1 124.46,86.36
  Top 0.813: v127.89,69.85 133.35,69.85 v140.97,77.47 144.78,81.28 144.78,83.82 146.05,85.09 VC.1
  Bottom 0.254: C6.2 68.9,73.24 IC4.16 | C7.2 36.51,73.24 IC5.16 | 4.55,74.51 IC6.16 1.78,73.02 1.27,72.52 1.27,66.04 1.9,65.41 IC6.10 | IC7.7 v104.14,33.66 | v104.14,41.27 IC7.1 99.19,41.27 98.81,41.66 98.81,43.11 C9.2 | IC4.10 v64.26,65.41 | C8.2 4.55,74.93 | IC3.10 v97.28,65.41 | IC5.10 37.46,65.41 38.1,66.04 38.1,71.37 v43.18,76.45 | R2.2 R1.2 128.39,70.36 v127.89,69.85 | R43.2 R44.2 148.27,87.44 150.62,85.09 VC.1
  Bottom 0.406: 134.05,82.41 134.26,82.19 IC1.41 | v135.25,83.82 135.25,82.68 133.54,82.68 C3.2 | IC1.8 146.69,69.72 140.97,75.44 v140.97,77.47 | C4.2 119.06,71.05 119.76,71.75 IC2.8 | IC1.8 147,69.41 148.53,67.88 C1.2 | IC1.8 IC1.7
  Bottom 0.61: 4.55,74.51 4.55,74.93 4.55,76.43 v4.57,76.45 | v15.24,76.45 36.7,76.45 | 36.7,76.45 v40.39,76.45 | C7.2 36.58,75 36.58,76.33 36.7,76.45 | v46.61,76.45 v64.26,76.45 v68.96,76.45 68.96,75 C6.2 | v79.12,76.45 v97.28,76.45 101.35,76.45 101.35,75 C5.2 101.28,73.24 IC3.16 | R42.2 11.11,76.39 v11.05,76.45 | IC8.7 v34.29,33.66 34.29,41.27 | 34.29,41.27 34.29,42.86 C10.2 | IC8.1 34.29,41.27 | C3.2 134.05,82.41 134.05,82.36
  Bottom 0.813: v104.14,33.66 117.73,33.66 118.36,33.02 C12.+ C13.+ | v127.89,69.85 C4.2
A0
  Top 0.254: DISP5.P$22 8.26,50.16 6.99,51.43 6.99,60.33 6.35,60.96 2.54,60.96 1.52,61.98 1.52,78.99 2.54,80.01 6.99,80.01 8.26,81.28 DISP1.P$22
  Bottom 0.254: DISP1.P$22 8.26,80.33 R25.1
A1
  Top 0.254: DISP5.P$19 15.88,50.16 14.61,51.43 14.61,59.94 17.65,62.99 17.65,76.33 14.61,79.38 14.61,81.22 DISP1.P$19
  Bottom 0.254: DISP1.P$19 15.88,80.33 R24.1
A2
  Top 0.254: DISP5.P$16 23.5,50.16 22.23,51.43 22.23,81.22 DISP1.P$16
  Bottom 0.254: DISP1.P$16 23.5,80.33 R23.1
A3
  Top 0.254: 31.11,50.16 DISP5.P$13 31.11,55.24 29.84,56.52 29.84,59.94 26.92,62.86 26.92,78.36 29.78,81.22 29.84,81.22 DISP1.P$13
  Bottom 0.254: DISP1.P$13 31.11,80.33 R22.1
A4
  Top 0.254: DISP5.P$3 8.26,47.62 9.4,48.77 9.4,51.43 8.26,52.58 DISP1.P$3
  Bottom 0.254: DISP1.P$3 8.26,60.64 R41.1
A5
  Top 0.254: DISP5.P$6 15.88,46.35 17.14,47.62 17.14,54.61 15.88,55.88 DISP1.P$6
  Bottom 0.254: DISP1.P$6 15.88,60.64 R40.1
A6
  Top 0.254: DISP5.P$9 23.5,46.86 24.77,48.13 24.77,57.21 DISP1.P$9
  Bottom 0.254: DISP1.P$9 23.5,60.64 R39.1
A7
  Top 0.254: DISP1.P$12 31.75,57.85 31.75,52.07 33.02,50.8 33.02,48.64 31.11,46.74 DISP5.P$12
  Bottom 0.254: DISP1.P$12 31.11,60.64 R38.1
A8
  Top 0.254: DISP6.P$22 40.64,50.16 33.78,57.02 33.78,74.04 40.64,80.9 DISP2.P$22
  Bottom 0.254: DISP2.P$22 40.64,80.33 R21.1
A9
  Top 0.254: DISP6.P$19 48.26,50.16 46.99,51.43 46.99,59.69 48.26,60.96 DISP2.P$19
  Bottom 0.254: DISP2.P$19 48.26,80.33 R20.1
A10
  Top 0.254: DISP6.P$16 55.88,50.16 54.61,51.43 54.61,81.22 DISP2.P$16
  Bottom 0.254: DISP2.P$16 55.88,80.33 R19.1
A11
  Top 0.254: DISP2.P$13 62.23,81.22 62.23,55.88 63.5,54.61 DISP6.P$13
  Bottom 0.254: DISP2.P$13 63.5,80.33 R18.1
A12
  Top 0.254: DISP6.P$3 41.34,26.1 41.91,26.67 41.91,57.21 DISP2.P$3
  Bottom 0.254: DISP2.P$3 40.64,60.64 R37.1
A13
  Top 0.254: DISP2.P$6 49.53,57.21 49.53,48.26 48.26,46.99 DISP6.P$6
  Bottom 0.254: DISP2.P$6 48.26,60.64 R36.1
A14
  Top 0.254: DISP6.P$9 56.58,26.1 57.15,26.67 57.15,57.21 DISP2.P$9
  Bottom 0.254: DISP2.P$9 55.88,60.64 R35.1
A15
  Top 0.254: DISP6.P$12 64.2,26.1 64.77,26.67 64.77,57.21 DISP2.P$12
  Bottom 0.254: DISP2.P$12 63.5,60.64 R34.1
A16
  Top 0.254: DISP7.P$22 73.03,50.16 66.04,57.15 66.04,75.5 DISP3.P$22
  Bottom 0.254: DISP3.P$22 73.03,80.33 R17.1
A17
  Top 0.254: DISP7.P$19 80.65,50.16 79.38,51.43 79.38,59.69 80.65,60.96 DISP3.P$19
  Bottom 0.254: DISP3.P$19 80.65,80.33 R16.1
A18
  Top 0.254: DISP7.P$16 88.27,50.16 87,51.43 87,81.22 DISP3.P$16
  Bottom 0.254: DISP3.P$16 88.27,80.33 R15.1
A19
  Top 0.254: DISP7.P$13 95.89,50.16 94.62,51.43 94.62,81.22 DISP3.P$13
  Bottom 0.254: DISP3.P$13 95.89,80.33 R14.1
A20
  Top 0.254: DISP7.P$3 73.85,26.1 74.42,26.67 74.42,57.09 DISP3.P$3
  Bottom 0.254: DISP3.P$3 73.03,60.33 72.39,60.96 R33.1
A21
  Top 0.254: DISP7.P$6 81.34,26.1 81.92,26.67 81.92,57.21 DISP3.P$6
  Bottom 0.254: DISP3.P$6 80.65,60.64 R32.1
A22
  Top 0.254: DISP7.P$9 88.97,26.1 89.54,26.67 89.54,57.21 DISP3.P$9
  Bottom 0.254: DISP3.P$9 88.27,60.64 R31.1
A23
  Top 0.254: DISP7.P$12 96.84,26.1 97.16,26.42 97.16,57.21 DISP3.P$12
  Bottom 0.254: DISP3.P$12 95.89,60.64 R30.1
A24  (via drill 0.6 pad 0.25)
  Top 0.254: DISP8.P$22 105.41,50.16 104.14,51.43 104.14,63.63 v103.12,64.64
  Bottom 0.254: DISP4.P$22 105.41,80.01 R13.1 105.09,70.8 103.12,68.83 v103.12,64.64
A25
  Top 0.254: DISP4.P$19 113.03,60.96 111.76,59.69 111.76,57.15 113.03,55.88 DISP8.P$19
  Bottom 0.254: DISP4.P$19 113.03,80.33 R12.1
A26
  Top 0.254: DISP8.P$16 120.65,50.16 119.38,51.43 119.38,61.59 121.92,64.13 121.92,79.38 120.65,80.64 DISP4.P$16
  Bottom 0.254: DISP4.P$16 120.65,80.33 R11.1
A27
  Top 0.254: DISP8.P$13 128.27,50.16 127,51.43 127,59.69 122.56,64.13 122.56,79.38 123.32,80.14 125.86,80.14 128.2,82.48 DISP4.P$13
  Bottom 0.254: DISP4.P$13 128.27,80.33 R10.1
A28
  Top 0.254: DISP8.P$3 106.11,26.1 106.68,26.67 106.68,51.43 105.41,52.7 DISP4.P$3
  Bottom 0.254: DISP4.P$3 105.41,60.64 R29.1
A29
  Top 0.254: DISP8.P$6 113.73,26.1 114.3,26.67 114.3,57.21 DISP4.P$6
  Bottom 0.254: DISP4.P$6 113.03,60.64 R28.1
A30
  Top 0.254: DISP8.P$9 121.35,26.1 121.92,26.67 121.92,57.21 DISP4.P$9
  Bottom 0.254: DISP4.P$9 120.65,60.64 R27.1
A31
  Top 0.254: DISP8.P$12 128.97,26.1 129.54,26.67 129.54,57.21 DISP4.P$12 128.27,58.42
  Bottom 0.254: DISP4.P$12 128.27,60.64 R26.1
AUXIN
  Bottom 0.254: AUXIN.1 141.41,86.42 143.45,86.42 144.53,85.34 144.53,84.58 143.52,83.58 143.39,83.58 IC1.51
AUXOUT
  Bottom 0.254: 129.54,87.95 GX.1 129.54,86.74 131.44,84.84 131.44,80.64 133.53,78.56 IC1.37
D_ACK  (via drill 0.6, 0.6 pad 0.25)
  Top 0.254: v2.79,66.67 v12.45,66.67 | v44.2,66.67 v34.54,66.67 | v76.71,66.67 v66.93,66.67 | v99.19,66.67 109.86,66.67 110.49,67.31 v111.63,67.31
  Bottom 0.254: IC6.11 v2.79,66.67 | v12.45,66.67 v29.59,66.67 v34.54,66.67 IC5.11 | v44.2,66.67 v66.93,66.67 IC4.11 | v76.71,66.67 v99.19,66.67 IC3.11 | v111.63,67.31 112.01,66.93 127.76,66.93 129.67,68.83 129.67,70.61 130.43,71.37 130.43,72.87 IC1.32 131.28,73.62
D_ADT  (via drill 0.6, 0.6 pad 0.25)
  Top 0.254: v2.79,70.48 2.79,71.37 3.18,71.75 v15.24,71.75 | v34.54,71.75 v46.61,71.75 | v66.8,71.75 v79.25,71.75 | v109.6,70.1 100.84,70.1 v99.19,71.75
  Bottom 0.254: IC6.14 v2.79,70.48 | v15.24,71.75 v34.54,71.75 | v46.61,71.75 v66.8,71.75 | v79.25,71.75 v99.19,71.75 | v109.6,70.1 110.49,69.22 110.49,67.31 111.38,66.42 128.02,66.42 130.17,68.58 130.17,70.36 130.94,71.12 130.94,72.26 131.06,72.39 131.19,72.39 131.86,73.06 IC1.31
D_ARK  (via drill 0.6, 0.6 pad 0.25)
  Top 0.254: v2.79,67.94 v12.45,67.94 | v44.2,67.94 v34.54,67.94 | v76.71,67.94 v66.93,67.94 | v99.19,67.94 v109.09,67.94
  Bottom 0.254: IC6.12 v2.79,67.94 | v12.45,67.94 v30.6,67.94 v34.54,67.94 IC5.12 | v44.2,67.94 v66.93,67.94 IC4.12 | v76.71,67.94 v99.19,67.94 IC3.12 | v109.09,67.94 111.12,65.91 130.28,65.91 IC1.26
D_ENA  (via drill 0.6, 0.6 pad 0.25)
  Top 0.254: v2.79,69.22 v12.45,69.22 12.7,69.22 | v44.2,69.22 v34.54,69.22 | v76.71,69.22 v66.93,69.22 | v99.19,69.22 111,69.22 v111.63,68.58
  Bottom 0.254: v2.79,69.22 IC6.13 7.62,69.22 9.21,70.8 R42.1 | v12.45,69.22 v31.56,69.22 v34.54,69.22 IC5.13 | v44.2,69.22 v66.93,69.22 IC4.13 | v76.71,69.22 v99.19,69.22 IC3.13 | v111.63,68.58 112.78,67.44 127.51,67.44 129.16,69.09 129.16,70.87 129.92,71.63 129.92,74.55 130.3,74.93 132.62,74.93 IC1.49
D_KCK  (via drill 0.6, 0.6 pad 0.25)
  Top 0.254: v38.73,33.66 36.83,33.66 33.78,36.7 v32.38,36.7 | v25.4,65.53 25.4,62.86 27.3,60.96 27.3,40.64 v27.94,40 | v109.22,51.94 109.22,46.99 107.82,45.59 v107.82,44.2
  Bottom 0.254: IC8.10 31.37,33.66 32.38,34.67 v32.38,36.7 32.38,39.24 31.62,40 IC8.15 v27.94,40 | IC7.10 95.89,33.66 96.52,34.29 96.52,39.5 96.01,40 IC7.15 92.58,40 | 92.58,40 59.05,40 53.34,34.29 39.37,34.29 v38.73,33.66 | v25.4,65.53 v28.45,65.53 | 92.58,40 92.58,43.94 93.22,44.58 106.43,44.58 106.81,44.2 v107.82,44.2 | v109.22,51.94 110.87,53.59 128.91,53.59 130.68,55.37 130.68,65.2 IC1.25
D_KDT  (via drill 0.6 pad 0.25)
  Top 0.254: v111.76,51.94 111.76,45.85 111,45.09 v108.97,45.09
  Bottom 0.254: IC8.2 37.72,40 38.61,40.89 38.61,44.58 39.12,45.09 v108.97,45.09 | v111.76,51.94 112.78,52.96 129.16,52.96 131.32,55.12 131.32,64.72 IC1.24
ENC1  (via drill 0.6 pad 0.25)
  Top 0.254: ENC1.B 147.57,11.68 147.57,18.92 150.11,21.46 150.11,34.04 147.57,36.58 147.57,55.24 152.4,60.07 152.4,71.88 151.38,72.9 149.1,72.9 148.84,73.15 148.84,74.68 148.72,74.8 v147.95,74.8
  Bottom 0.254: IC1.1 150.63,73.65 149.48,74.8 v147.95,74.8
ENC2  (via drill 0.6 pad 0.25)
  Top 0.254: ENC1.A 141.86,11.05 146.18,11.05 147.07,11.94 147.07,19.18 149.61,21.72 149.61,33.78 147.07,36.32 147.07,55.63 151.76,60.33 151.76,71.63 151.13,72.26 148.21,72.26 147.95,72.52 v147.95,73.53
  Bottom 0.254: IC1.2 150.08,73.06 149.48,73.66 148.08,73.66 v147.95,73.53
GATE1
  Bottom 0.254: G3.1 137.29,85.47 137.29,84.84 137.99,84.14 137.99,84.04 IC1.46
GATE2
  Bottom 0.254: G2.1 133.35,89.41 133.35,87.5 133.98,86.87 135.19,86.87 136.78,85.28 136.78,84.2 137.41,83.57 137.41,83.5 IC1.45
GATE3
  Bottom 0.254: G4.1 133.79,86.42 134.94,86.42 136.27,85.09 136.27,83.57 136.84,83 136.84,82.95 IC1.44
GATE4
  Bottom 0.254: G1.1 130.81,89.41 130.81,86.36 132.08,85.09 132.08,81.03 134.08,79.02 IC1.38
GND  (via drill 0.6)
  other vias: 13.21,64.13 94.74,43.18 100.08,31.11 109.09,64.13 95.76,74.93 83.12,74.93 81.66,64.13 76.96,64.13 57.4,74.3 45.47,64.13 52.45,64.13 56.13,64.01 15.24,74.8 19.18,74.8 25.65,74.68 40.26,33.02 26.29,33.02 45.72,32.89 61.21,32.89 29.46,74.68 30.73,63.25 35.81,61.98 114.81,69.85 111.63,70.1 111.63,71.37 111.63,72.64 114.81,68.58 132.21,86.23 141.22,61.72 146.94,61.47 62.74,43.18 85.47,43.31 104.27,43.31 111.89,43.31 116.97,43.31 100.33,80.01 90.81,80.07 83.12,80.07 75.5,80.07 67.06,80.07 57.4,79.12 49.66,79.12 43.05,79.12 34.92,79.25 25.65,79.25 18.67,79.25 10.79,79.25 143.51,45.72 61.21,74.3 54.61,32.89 58.42,32.89
  pour Top: -8.89,95.25 -12.7,95.25 -12.7,-10.16 167.64,-10.16 167.64,96.52 -8.89,96.52
  pour Bottom: -5.08,95.25 -6.35,95.25 -6.35,-5.08 161.29,-5.08 161.29,97.79 -5.08,97.79
I2C0SCL  (via drill 0.6)
  Top 0.254: SCL.1 135.89,89.41 143.19,89.41 144.72,90.93 v145.03,90.93
  Bottom 0.254: SCL.1 135.89,89.41 135.89,87.5 137.92,85.47 137.92,85.34 138.49,84.77 138.49,84.64 IC1.47 | R43.1 v145.03,90.93
I2C0SDA  (via drill 0.6)
  Top 0.254: v145.03,88.65 143,86.61 138.68,86.61 SDA.1
  Bottom 0.254: R44.1 v145.03,88.65 | IC1.48 139.06,85.19 139.06,85.34 137.16,87.25 SDA.1
I2C1SCL  (via drill 0.6)
  Top 0.254: v144.14,76.96 142.49,76.96 134.11,68.58 125.73,68.58 124.84,69.47 v124.84,72.9
  Bottom 0.254: R1.1 126.43,72.9 v124.84,72.9 123.44,74.3 IC2.6 | IC1.59 147.85,79.02 145.8,76.96 v144.14,76.96
I2C1SDA  (via drill 0.6)
  Top 0.254: v144.91,75.82 143.89,75.82 143.26,76.45 142.75,76.45 134.37,68.07 125.48,68.07 123.95,69.6 v123.95,75.56
  Bottom 0.254: IC2.5 v123.95,75.56 R2.1 | IC1.60 148.41,78.43 145.8,75.82 v144.91,75.82
K0  (via drill 0.6)
  Top 0.254: DISP4.P$23 v102.87,86.74 | DISP3.P$23 v70.48,86.74 | v38.1,86.74 DISP2.P$23 38.1,79.25 33.02,74.17 33.02,52.32 34.04,51.31 34.04,46.35 36.32,44.07 39.5,44.07 40,43.56 v40,43.18
  Bottom 0.254: IC8.3 38.1,38.73 40,40.64 v40,43.18 | v102.87,86.74 v70.48,86.74 v38.1,86.74 8,86.74 5.71,84.45 DISP1.P$23
K1  (via drill 0.6)
  Top 0.254: DISP4.P$20 v110.49,85.98 | DISP3.P$20 v78.11,85.98 | v45.72,85.98 DISP2.P$20 45.72,80.64 47.62,78.74 47.62,62.86 44.45,59.69 v44.45,43.18
  Bottom 0.254: DISP1.P$20 13.34,85.09 14.22,85.98 v45.72,85.98 v78.11,85.98 v110.49,85.98 | IC8.4 41.27,37.46 44.45,40.64 v44.45,43.18
K2  (via drill 0.6)
  Top 0.254: DISP4.P$17 v118.11,85.22 | DISP3.P$17 v85.73,85.22 | v53.34,85.22 DISP2.P$17 50.8,79.94 50.8,60.96 52.07,59.69 v52.07,43.18
  Bottom 0.254: DISP1.P$17 20.96,84.45 21.72,85.22 v53.34,85.22 v85.73,85.22 v118.11,85.22 | IC8.5 47.62,36.2 52.07,40.64 v52.07,43.18
K3  (via drill 0.6)
  Top 0.254: v58.42,43.18 59.69,44.45 59.69,78.74 60.96,80.01 DISP2.P$14
  Bottom 0.254: DISP1.P$14 28.57,83.82 29.21,84.45 60.96,84.45 | 60.96,84.45 93.34,84.45 | 93.34,84.45 125.09,84.45 125.73,83.82 DISP4.P$14 | IC8.6 52.7,34.92 58.42,40.64 v58.42,43.18 | DISP3.P$14 93.34,84.45 | DISP2.P$14 60.96,84.45
K4  (via drill 0.6)
  Top 0.254: v4.45,43.18 4.45,51.43 5.71,52.7 DISP1.P$2 | DISP4.P$2 v102.87,54.23 | DISP3.P$2 v70.48,54.23 | DISP2.P$2 v38.1,54.23
  Bottom 0.254: DISP1.P$2 5.71,55.24 6.73,54.23 v38.1,54.23 v70.48,54.23 v102.87,54.23 | IC8.11 8.26,34.92 4.45,38.73 v4.45,43.18
K5  (via drill 0.6)
  Top 0.254: DISP4.P$5 v110.49,54.99 | DISP3.P$5 v78.11,54.99 | DISP2.P$5 v45.72,54.99 | DISP1.P$5 13.34,56.01 12.07,54.74 v12.07,43.18
  Bottom 0.254: DISP1.P$5 13.34,55.88 14.22,54.99 v45.72,54.99 v78.11,54.99 v110.49,54.99 | IC8.12 13.34,36.2 12.07,37.46 v12.07,43.18
K6  (via drill 0.6)
  Top 0.254: DISP4.P$8 v118.11,55.75 | DISP3.P$8 v85.73,55.75 | DISP2.P$8 v53.34,55.75 | DISP1.P$8 20.96,55.88 19.68,54.61 v19.68,43.18
  Bottom 0.254: v118.11,55.75 v85.73,55.75 v53.34,55.75 23.69,55.75 DISP1.P$8 | IC8.13 21.59,37.46 19.68,39.37 v19.68,43.18
K7  (via drill 0.6)
  Top 0.254: DISP1.P$11 28.57,53.34 29.84,52.07 29.84,39.37 29.21,38.73 v27.94,38.73
  Bottom 0.254: DISP1.P$11 28.57,57.15 29.21,56.52 60.96,56.52 | 60.96,56.52 93.22,56.52 | 93.22,56.52 125.73,56.52 DISP4.P$11 | DISP3.P$11 93.34,56.64 93.22,56.52 | DISP2.P$11 60.96,56.52 | v27.94,38.73 IC8.14
K8  (via drill 0.6)
  Top 0.254: DISP8.P$23 v102.87,45.97 | DISP7.P$23 v70.48,45.97 | DISP6.P$23 v38.1,45.97
  Bottom 0.254: DISP5.P$23 5.71,46.04 5.65,45.97 | 5.65,45.97 v38.1,45.97 v70.48,45.97 v102.87,45.97 109.73,45.97 109.98,45.72 109.98,39.24 109.47,38.73 IC7.3 | 5.65,45.97 3.75,45.97 3.18,45.4 3.18,28.64 4.45,27.37 4.45,22.16 5.02,21.59 15.24,21.59 22.61,14.22 D7.A
K9  (via drill 0.6)
  Top 0.254: DISP8.P$20 v110.49,46.74 | DISP7.P$20 v78.11,46.74 | DISP6.P$20 v45.72,46.74
  Bottom 0.254: IC7.4 109.86,37.46 110.49,38.1 v110.49,46.74 v78.11,46.74 v45.72,46.74 14.86,46.74 13.34,48.26 DISP5.P$20 13.34,52.07 13.21,52.2 2.29,52.2 1.78,51.69 1.78,17.27 5.08,13.97 7.62,13.97 D8.A
K10  (via drill 0.6)
  Top 0.254: DISP8.P$17 v118.11,47.5 | DISP7.P$17 v85.73,47.5 | DISP6.P$17 v53.34,47.5 53.34,43.18 52.07,41.91 52.07,24.13 v50.8,22.86
  Bottom 0.254: 1.27,44.45 1.27,51.94 2.03,52.7 18.35,52.7 DISP5.P$17 20.96,48.26 21.72,47.5 v53.34,47.5 v85.73,47.5 v118.11,47.5 118.11,36.83 117.48,36.2 IC7.5 | v50.8,22.86 50.8,21.59 43.17,13.96 D6.A
K11  (via drill 0.6 pad 0.25)
  Top 0.254: DISP6.P$14 60.96,41.91 59.69,40.64 v59.69,22.86
  Bottom 0.254: 60.96,48.26 93.47,48.26 | 93.47,48.26 119,48.26 | DISP8.P$14 125.73,48.26 119,48.26 | DISP7.P$14 93.34,48.39 93.47,48.26 | DISP6.P$14 60.96,48.26 | 60.96,48.26 29.21,48.26 28.57,48.89 DISP5.P$14 25.46,53.21 1.78,53.21 | 119,48.26 119,36.45 117.48,34.92 IC7.6 | D5.A 57.15,20.32 v59.69,22.86
K12  (via drill 0.6)
  Top 0.254: DISP8.P$2 v102.87,30.23 | DISP7.P$2 v70.48,30.23 v70.48,34.92 | DISP6.P$2 v38.1,30.23
  Bottom 0.254: DISP5.P$2 5.71,29.21 6.73,30.23 v38.1,30.23 v70.48,30.23 v102.87,30.23 | IC7.11 v70.48,34.92 | DISP7.P$2 70.48,24.77 73.66,21.59 D4.A
K13  (via drill 0.6)
  Top 0.254: DISP8.P$5 v110.49,29.46 | DISP7.P$5 v78.11,29.46 v78.11,36.2 | DISP6.P$5 v45.72,29.46 | v135.89,29.46 135.89,33.02 135.89,33.66 v137.79,35.56
  Bottom 0.254: DISP5.P$5 13.34,28.57 14.22,29.46 v45.72,29.46 v78.11,29.46 v110.49,29.46 v135.89,29.46 | IC7.12 v78.11,36.2 | DISP7.P$5 78.11,23.5 78.74,22.86 88.9,22.86 90.17,21.59 D3.A | v137.79,35.56 D11.A
K14  (via drill 0.6)
  Top 0.254: DISP8.P$8 v118.11,28.7 | DISP7.P$8 v85.73,28.7 v85.73,37.34 | DISP6.P$8 v53.34,28.7 | v143.51,28.7 143.51,33.02 143.51,33.66 v145.41,35.56
  Bottom 0.254: DISP5.P$8 20.96,28.19 21.46,28.7 v53.34,28.7 v85.73,28.7 v118.11,28.7 v143.51,28.7 | IC7.13 85.85,37.46 v85.73,37.34 | DISP8.P$8 118.11,24.13 116.84,22.86 107.95,22.86 106.68,21.59 D2.A | v145.41,35.56 D10.A
K15  (via drill 0.6)
  Top 0.254: v92.71,38.73 92.71,26.74 DISP7.P$11
  Bottom 0.254: DISP5.P$11 28.57,27.56 28.96,27.94 60.96,27.94 | 60.96,27.94 93.47,27.94 | 93.47,27.94 101.6,27.94 | 101.6,27.94 125.73,27.94 | 125.73,27.94 DISP8.P$11 123.2,23.57 D1.A | DISP6.P$11 60.96,27.94 | 101.61,27.94 101.6,27.94 | DISP7.P$11 93.34,27.81 93.47,27.94 | IC7.14 v92.71,38.73 | 125.73,27.94 151.13,27.94 D9.A
KEY_READ1  (via drill 0.6 pad 0.25)
  Top 0.254: SW1.1 5.13,8.94 6.35,10.16 21.59,10.16 | 21.59,10.16 38.1,10.16 | 38.1,10.16 54.61,10.16 | 54.61,10.16 71.12,10.16 | 71.12,10.16 87.63,10.16 | 87.63,10.16 104.14,10.16 | 104.14,10.16 120.65,10.16 120.7,10.11 | SW2.1 21.64,10.11 21.59,10.16 | SW3.1 38.15,10.11 38.1,10.16 | SW4.1 54.66,10.11 54.61,10.16 | SW5.1 71.17,10.11 71.12,10.16 | SW6.1 87.68,10.11 87.63,10.16 | SW7.1 104.19,10.11 104.14,10.16 | SW8.1 120.7,10.11 | 120.7,10.11 133.3,10.11 142.11,18.92 142.11,33.66 139.7,36.07 139.7,48.77 140.46,49.53 146.05,49.53 146.56,50.04 146.56,56.01 151.13,60.58 151.13,71.37 150.88,71.63 146.18,71.63 v143.89,73.91
  Bottom 0.254: v143.89,73.91 142.75,75.06 142.75,81.72 IC1.52
KEY_READ2
  Bottom 0.254: SW11.4 153.39,44.17 152.4,43.18 145.8,43.18 | 145.8,43.18 139.19,43.18 138.18,44.2 138.18,46.41 SW9.4 138.18,46.46 138.18,57.4 137.03,58.55 137.03,64.77 137.92,65.66 137.92,65.76 IC1.19 138.52,66.38 | SW10.4 145.77,43.2 145.8,43.18
LED1
  Bottom 0.254: LED3.A 148.59,57.15 139.7,57.15 137.67,59.18 137.67,64.26 138.43,65.02 138.43,65.15 IC1.18
LED2  (via drill 0.6 pad 0.25)
  Top 0.254: LED2.A 138.43,54.61 137.16,55.88 136.52,56.52 135.64,57.4 135.64,62.74 136.27,63.37 v136.27,64.13
  Bottom 0.254: 137.99,66.87 IC1.20 136.27,65.14 v136.27,64.13
LED3  (via drill 0.6 pad 0.25)
  Top 0.254: v135,64.13 135,55.5 LED1.A
  Bottom 0.254: 137.43,67.45 IC1.21 137.18,67.2 135,65.02 v135,64.13
MIDIRX
  Bottom 0.254: RX.1 128.27,89.41 128.27,87.12 130.81,84.58 130.81,77.85 IC1.34
MIDITX
  Bottom 0.254: TX.1 127,87.5 130.17,84.33 130.17,77.37 IC1.33
N$1
  Bottom 0.254: D10.C 143.11,38.07 SW10.1
N$2
  Bottom 0.254: R7.2 150.18,51.12 LED3.K
N$3
  Bottom 0.254: R8.2 142.56,51.12 LED2.K
N$4
  Bottom 0.254: IC1.11 145.06,68.04 146.18,66.93 146.18,64.26 146.5,63.94 XTL1.2 151.9,63.94 C2.2 151.96,62.23 R6.2
N$5
  Bottom 0.254: IC1.12 144.51,67.45 145.41,66.55 145.41,61.59 XTL1.1 146.07,58.8 C11.2 148.15,60.33 R6.1
N$6
  Bottom 0.254: R9.2 134.94,51.12 LED1.K
N$7
  Bottom 0.254: D9.C 150.73,38.07 SW11.1
N$8
  Bottom 0.254: D11.C 135.49,38.07 SW9.1
N$9
  Bottom 0.254: D7.C 24.14,7.62 25.4,6.35 26.52,6.35 SW2.3
N$10
  Bottom 0.254: IC1.22 134.24,65.41 133.6,64.78 PD7.TP
N$11
  Bottom 0.254: D8.C 7.62,7.62 8.89,6.35 10.01,6.35 SW1.3
N$12
  Bottom 0.254: IC1.23 132.97,65.26 132.08,64.37 132.08,61.09 PD6.TP
N$13
  Bottom 0.254: D6.C 40.64,7.62 41.91,6.35 43.03,6.35 SW3.3
N$14
  Bottom 0.254: D5.C 57.15,7.62 58.42,6.35 59.54,6.35 SW4.3
N$15  (via drill 0.6)
  Bottom 0.254: IC1.27 134.09,70.84 138.68,75.44 PF7.TP
  other vias: 138.68,78.11
N$16
  Bottom 0.254: D4.C 73.67,7.62 74.93,6.35 76.05,6.35 SW5.3
N$17
  Bottom 0.254: R25.2 6.04,72.08 5.71,71.75 IC6.15
N$18
  Bottom 0.254: IC6.1 12.07,73.02 12.7,73.66 12.7,79.05 R24.2
N$19
  Bottom 0.254: IC6.2 12.07,71.75 13.34,73.02 13.34,77.47 13.97,78.11 19.37,78.11 R23.2
N$20
  Bottom 0.254: IC6.3 12.07,70.48 13.97,72.39 13.97,76.83 14.61,77.47 26.36,77.47 R22.2
N$21
  Bottom 0.254: R41.2 6.04,65.72 9.53,69.22 IC6.4
N$22
  Bottom 0.254: IC6.5 9.53,67.94 7.62,66.04 7.62,64.13 10.79,60.96 R40.2
N$23
  Bottom 0.254: IC6.6 9.53,66.67 8.26,65.41 8.26,64.13 9.53,62.86 19.37,62.86 R39.2
N$24
  Bottom 0.254: IC6.7 22.23,65.41 26.67,60.96 R38.2
N$25  (via drill 0.6)
  Top 0.254: 137.16,76.58 PF6.TP
  Bottom 0.254: IC1.28 133.62,71.39 137.03,74.8 PF6.TP
  other vias: 137.03,76.71
N$26  (via drill 0.6)
  Bottom 0.254: IC1.29 133.04,71.95 135.38,74.3 PF5.TP
  other vias: 135.38,75.31
N$27  (via drill 0.6)
  Bottom 0.254: IC1.30 132.45,72.5 PF4.TP
  other vias: 133.86,73.91
N$30  (via drill 0.6)
  Top 0.254: v13.59,70.48 13.59,66.17 12.83,65.41 3.94,65.41 v2.67,64.13
  Bottom 0.254: IC5.14 v13.59,70.48 | v2.67,64.13 IC6.9
N$31  (via drill 0.6)
  Top 0.254: v45.34,70.48 45.34,66.04 44.7,65.41 35.18,65.41 34.54,64.77 v34.54,64.13
  Bottom 0.254: IC4.14 v45.34,70.48 | v34.54,64.13 IC5.9
N$32  (via drill 0.6)
  Top 0.254: v78.11,70.48 78.11,66.42 77.09,65.41 68.2,65.41 v66.93,64.13
  Bottom 0.254: IC3.14 v78.11,70.48 | v66.93,64.13 IC4.9
N$36  (via drill 0.6)
  Bottom 0.254: IC1.14 143.39,66.41 141.99,67.82 PH1.TP
  other vias: 141.99,70.36
N$37  (via drill 0.6)
  Bottom 0.254: IC1.15 142.84,65.82 141.22,67.44 141.22,69.09 PH0.TP
  other vias: 139.83,70.48
N$38  (via drill 0.6)
  Top 0.254: 139.95,67.82 PE6.TP 139.45,68.07
  Bottom 0.254: IC1.16 142.25,65.27 139.45,68.07 PE6.TP
  other vias: 139.45,68.33
N$41  (via drill 0.6)
  Bottom 0.254: IC1.4 148.9,71.95 148.46,72.39 146.69,72.39 146.05,73.02 PH6.TP
  other vias: 146.05,74.04
N$43  (via drill 0.6)
  Top 0.254: 145.54,79.12 PG1.TP
  Bottom 0.254: IC1.57 146.69,80.14 PG1.TP
  other vias: 145.16,78.74
N$49
  Bottom 0.254: IC5.15 37.46,71.75 41.91,76.2 41.91,77.47 41.02,78.36 38.86,78.36 38.42,78.8 R21.2 38.1,79.69
N$50
  Bottom 0.254: IC5.1 43.81,73.02 44.45,73.66 44.45,78.74 45.72,80.01 R20.2
N$51
  Bottom 0.254: IC5.2 43.81,71.75 45.08,73.02 45.08,77.47 45.72,78.11 51.75,78.11 R19.2
N$52
  Bottom 0.254: IC5.3 43.81,70.48 45.72,72.39 45.72,76.83 46.35,77.47 58.74,77.47 R18.2
N$53
  Bottom 0.254: 38.1,61.28 R37.2 38.48,61.02 38.48,61.85 39.62,62.99 39.62,67.69 41.15,69.22 IC5.4
N$54
  Bottom 0.254: IC5.5 40.64,67.94 40.13,67.44 40.13,63.25 41.02,62.36 45.59,62.36 46.04,61.91 R36.2
N$55
  Bottom 0.254: R35.2 51.75,62.86 41.27,62.86 40.64,63.5 40.64,66.55 40.77,66.67 IC5.6
N$56
  Bottom 0.254: IC5.7 56.83,65.41 R34.2
N$60
  Bottom 0.254: D3.C 90.17,7.62 91.44,6.35 92.71,6.35 92.71,6.4 SW6.3
N$61
  Bottom 0.254: D2.C 106.69,7.62 107.95,6.35 109.07,6.35 SW7.3
N$62
  Bottom 0.254: D1.C 123.2,7.62 124.46,6.35 125.58,6.35 SW8.3
N$81
  Bottom 0.254: IC4.15 69.85,71.75 70.48,72.39 70.48,79.69 R17.2
N$82
  Bottom 0.254: IC4.1 76.2,73.02 76.84,73.66 76.84,79.38 77.47,80.01 R16.2
N$83
  Bottom 0.254: IC4.2 76.2,71.75 77.47,73.02 77.47,77.47 78.11,78.11 84.14,78.11 R15.2
N$84
  Bottom 0.254: IC4.3 76.2,70.48 78.11,72.39 78.11,76.83 78.74,77.47 91.12,77.47 R14.2
N$85
  Bottom 0.254: IC4.4 71.12,69.22 70.48,68.58 70.48,61.28 R33.2
N$86
  Bottom 0.254: IC4.5 71.76,67.94 71.12,67.31 71.12,62.86 71.76,62.23 77.16,62.23 R32.2
N$87
  Bottom 0.254: IC4.6 72.39,66.67 71.76,66.04 71.76,63.5 72.39,62.86 84.14,62.86 R31.2
N$88
  Bottom 0.254: IC4.7 89.22,65.41 R30.2
N$113
  Bottom 0.254: IC3.15 102.23,71.75 102.87,72.39 102.87,79.69 R13.2
N$114
  Bottom 0.254: IC3.1 107.21,76.41 R12.2
N$115
  Bottom 0.254: IC3.2 108.59,71.75 108.84,72.01 108.84,76.45 109.86,77.47 110.17,77.79 110.49,78.11 116.53,78.11 R11.2
N$116
  Bottom 0.254: IC3.3 108.71,70.48 109.47,71.25 109.47,75.82 110.49,76.83 110.81,77.15 111.12,77.47 123.51,77.47 R10.2
N$117
  Bottom 0.254: R29.2 102.87,61.28 102.87,61.72 104.39,63.25 104.39,67.69 105.92,69.22 IC3.4
N$118
  Bottom 0.254: R28.2 109.54,62.23 105.92,62.23 104.9,63.25 104.9,67.18 105.66,67.94 IC3.5
N$119
  Bottom 0.254: R27.2 116.53,62.86 106.05,62.86 105.54,63.37 105.54,66.42 105.79,66.67 IC3.6
N$120
  Bottom 0.254: IC3.7 121.61,65.41 R26.2
N$122
  Bottom 0.254: IC8.9 32.64,32.38 33.91,31.11 98.17,31.11 98.81,31.75 98.81,39.5 99.31,40 IC7.2
NRESET
  Top 0.254: RT.1 153.29,80.01
  Bottom 0.254: IC1.63 150.08,76.8 153.29,80.01 RT.1
OFF_SW  (via drill 0.6)
  Top 0.254: v153.35,70.87 153.35,72.58 151.7,74.23 151.7,81.98 v151.13,82.55
  Bottom 0.254: OFFSW.1 143.32,90.68 144.08,89.92 144.08,88.08 145.29,86.87 146.81,86.87 v151.13,82.55 | 148.44,71.39 IC1.5 148.69,71.14 149.73,70.1 153.16,70.1 153.35,70.3 v153.35,70.87
PG0  (via drill 0.6)
  Bottom 0.254: 147.29,79.6 IC1.58 148.97,81.23 PG0.TP
  other vias: 148.97,81.53
PTG2  (via drill 0.6)
  Bottom 0.254: 146.23,80.69 IC1.56 147.7,82.23 PG2.TP
  other vias: 147.7,83.19
PTH2
  Bottom 0.254: IC1.6 147.86,70.83 149.22,69.47 152.4,69.47 PH2.TP
PTH7
  Bottom 0.254: 150.11,71.88 149.52,72.48 IC1.3 150.75,71.37 PH7.TP
PWR_CTRL
  Bottom 0.254: PWRCTL.1 140.97,89.41 140.97,87.5 141.6,86.87 143.76,86.87 146.05,84.58 146.05,82.8 145.33,82.09 IC1.54 145.06,81.82
SWDCLK
  Bottom 0.254: CK.1 152.02,80.9 152.02,79.88 149.52,77.38 IC1.62
SWDIO
  Bottom 0.254: DT.1 151.86,77.47 IC1.64
SYNCIN
  Bottom 0.254: CLKIN.1 138.43,89.41 138.43,87.5 139.95,85.98 143.13,85.98 143.89,85.22 143.04,84.36 IC1.50 142.84,84.04
SYNCOUT
  Bottom 0.254: IC1.61 148.96,77.97 150.37,79.38 150.37,82.42 146.43,86.36 145.03,86.36 143.89,87.5 142.88,87.5 CKOUT.1

### Text on the board
tPlace: NOODLEBOX Main Board v5 | hotchk155